# EasyEDA Pro project 平衡车.eprj

# Schematic Schematic1

## Sheets
1 stm32: Create Date: 2022-08-05; Page Name: stm32; Project Name: 平衡车; Schematic Name: Schematic1; Update Date: 2022-08-08
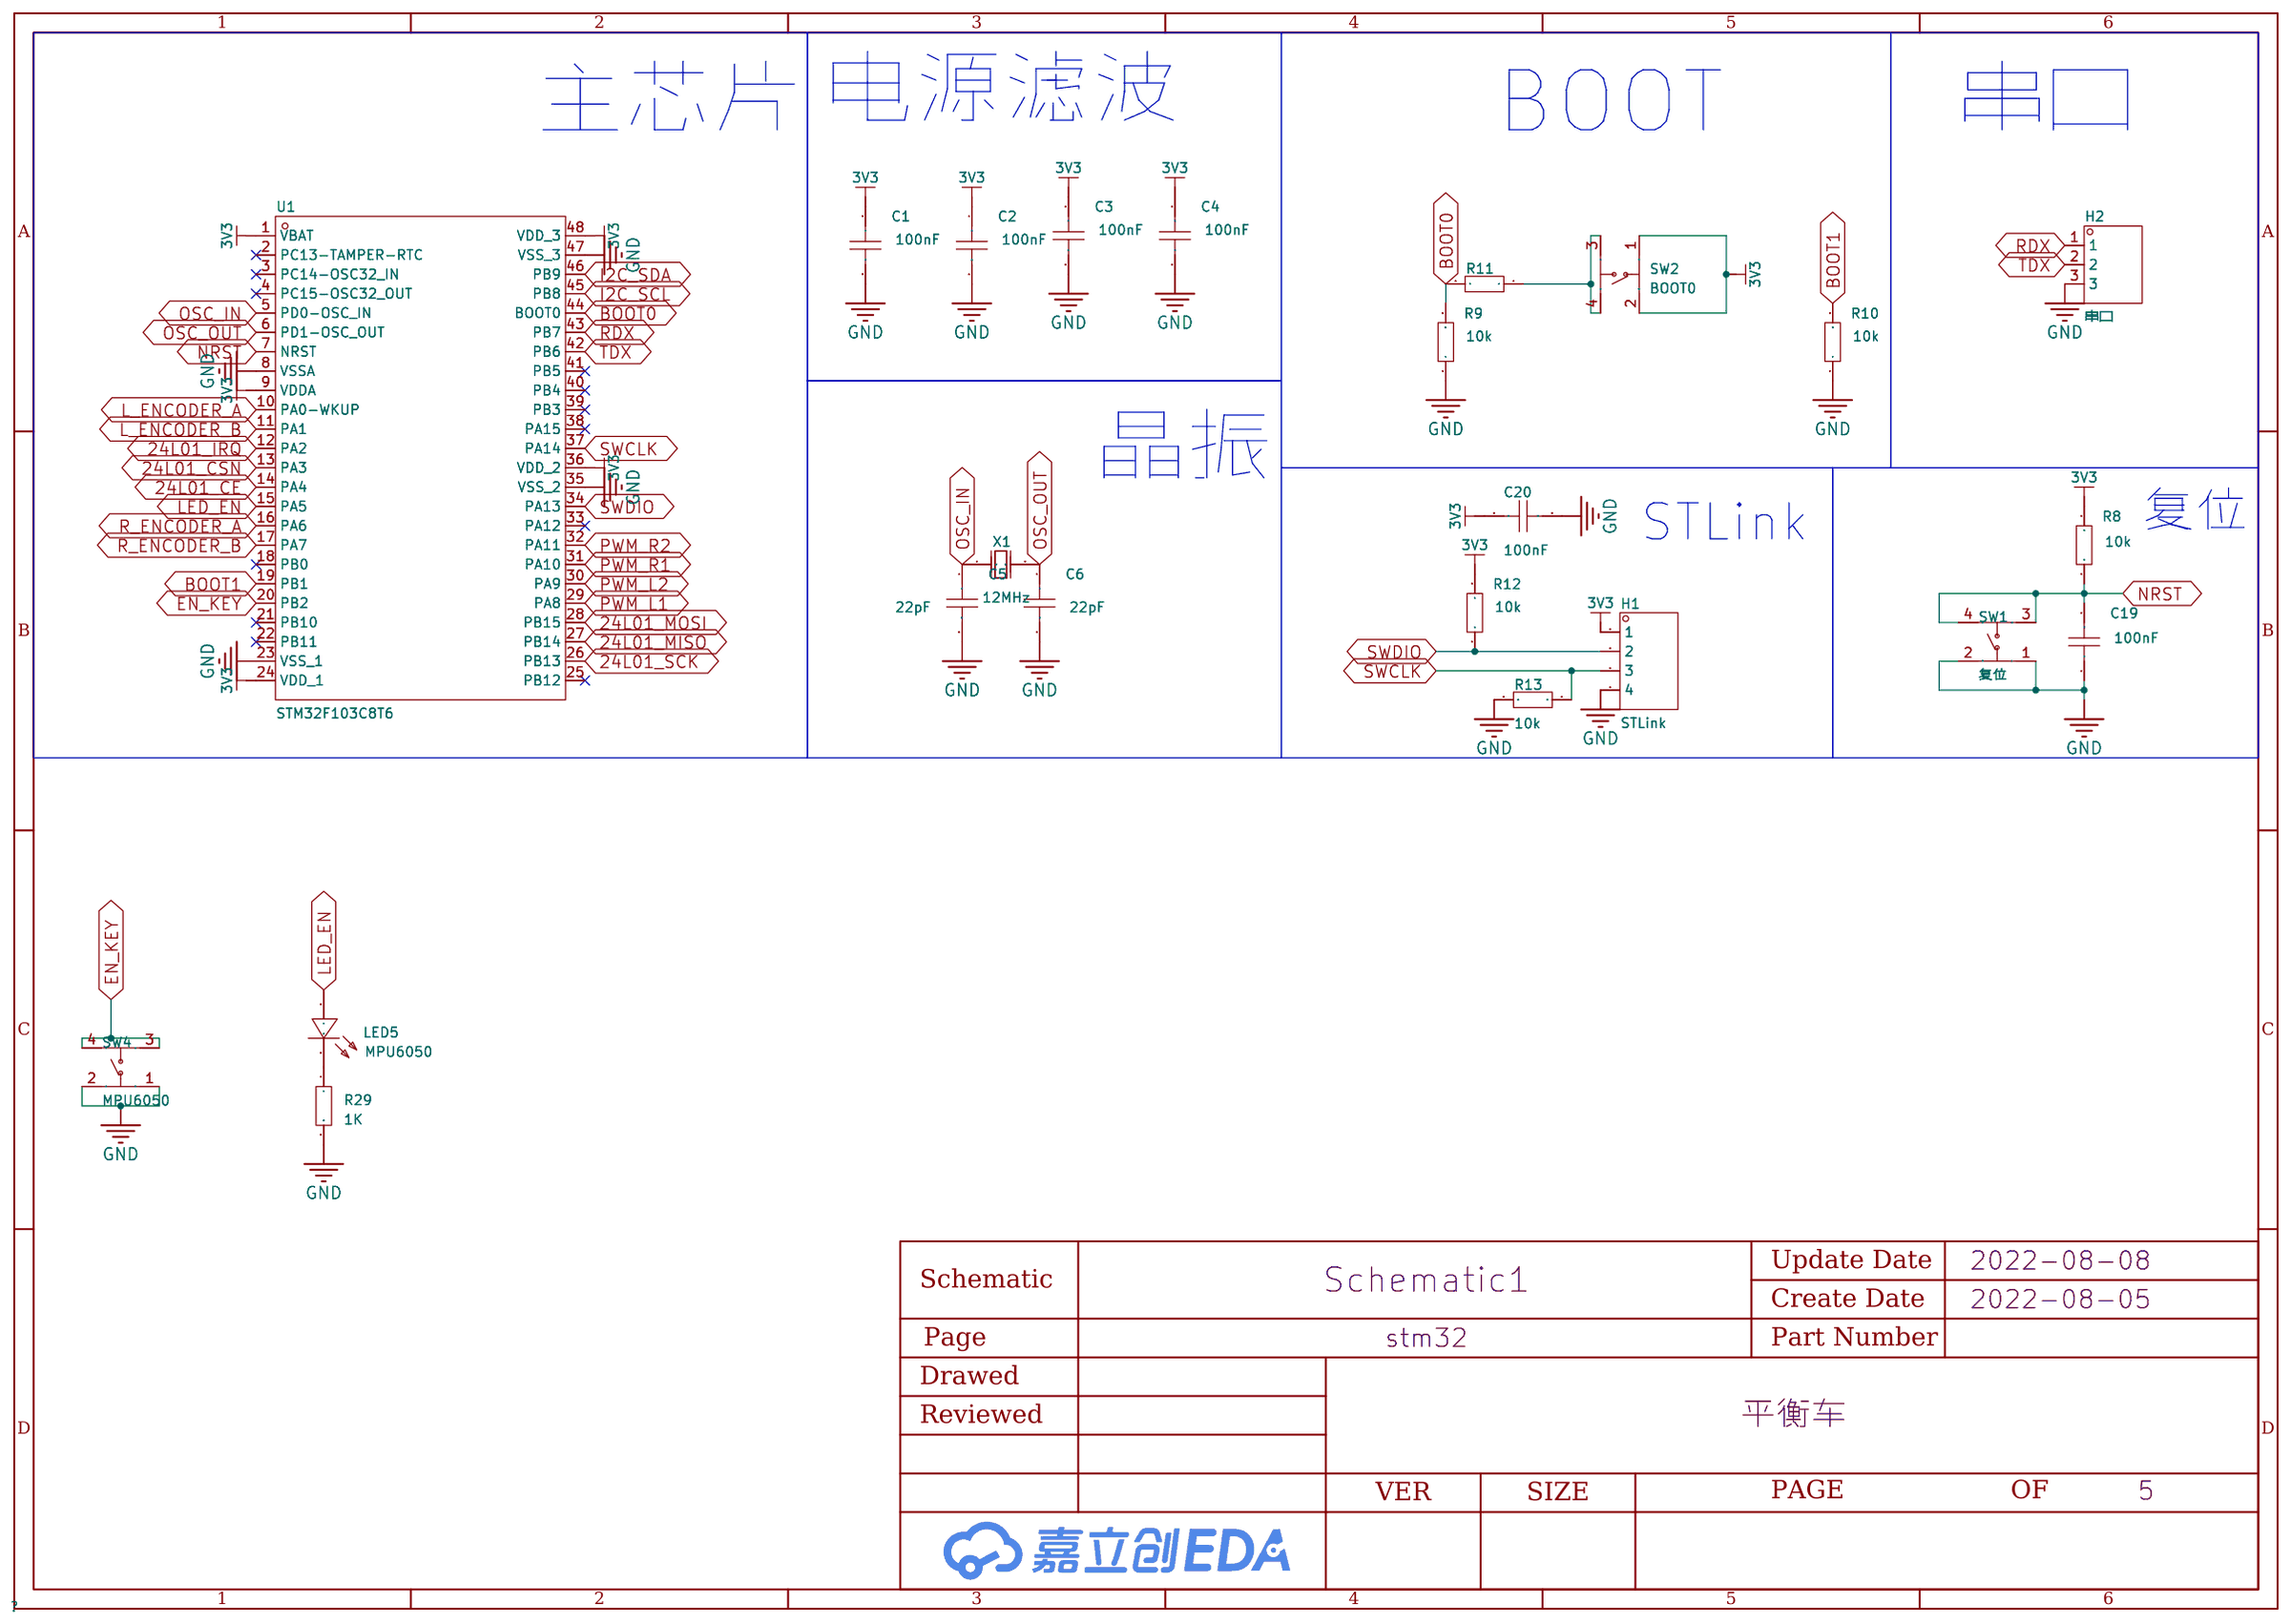
[diagram p0: stm32]
2 mpu6050: Page Name: mpu6050; Update Date: 2022-08-24; Add into BOM: yes; Convert to PCB: yes
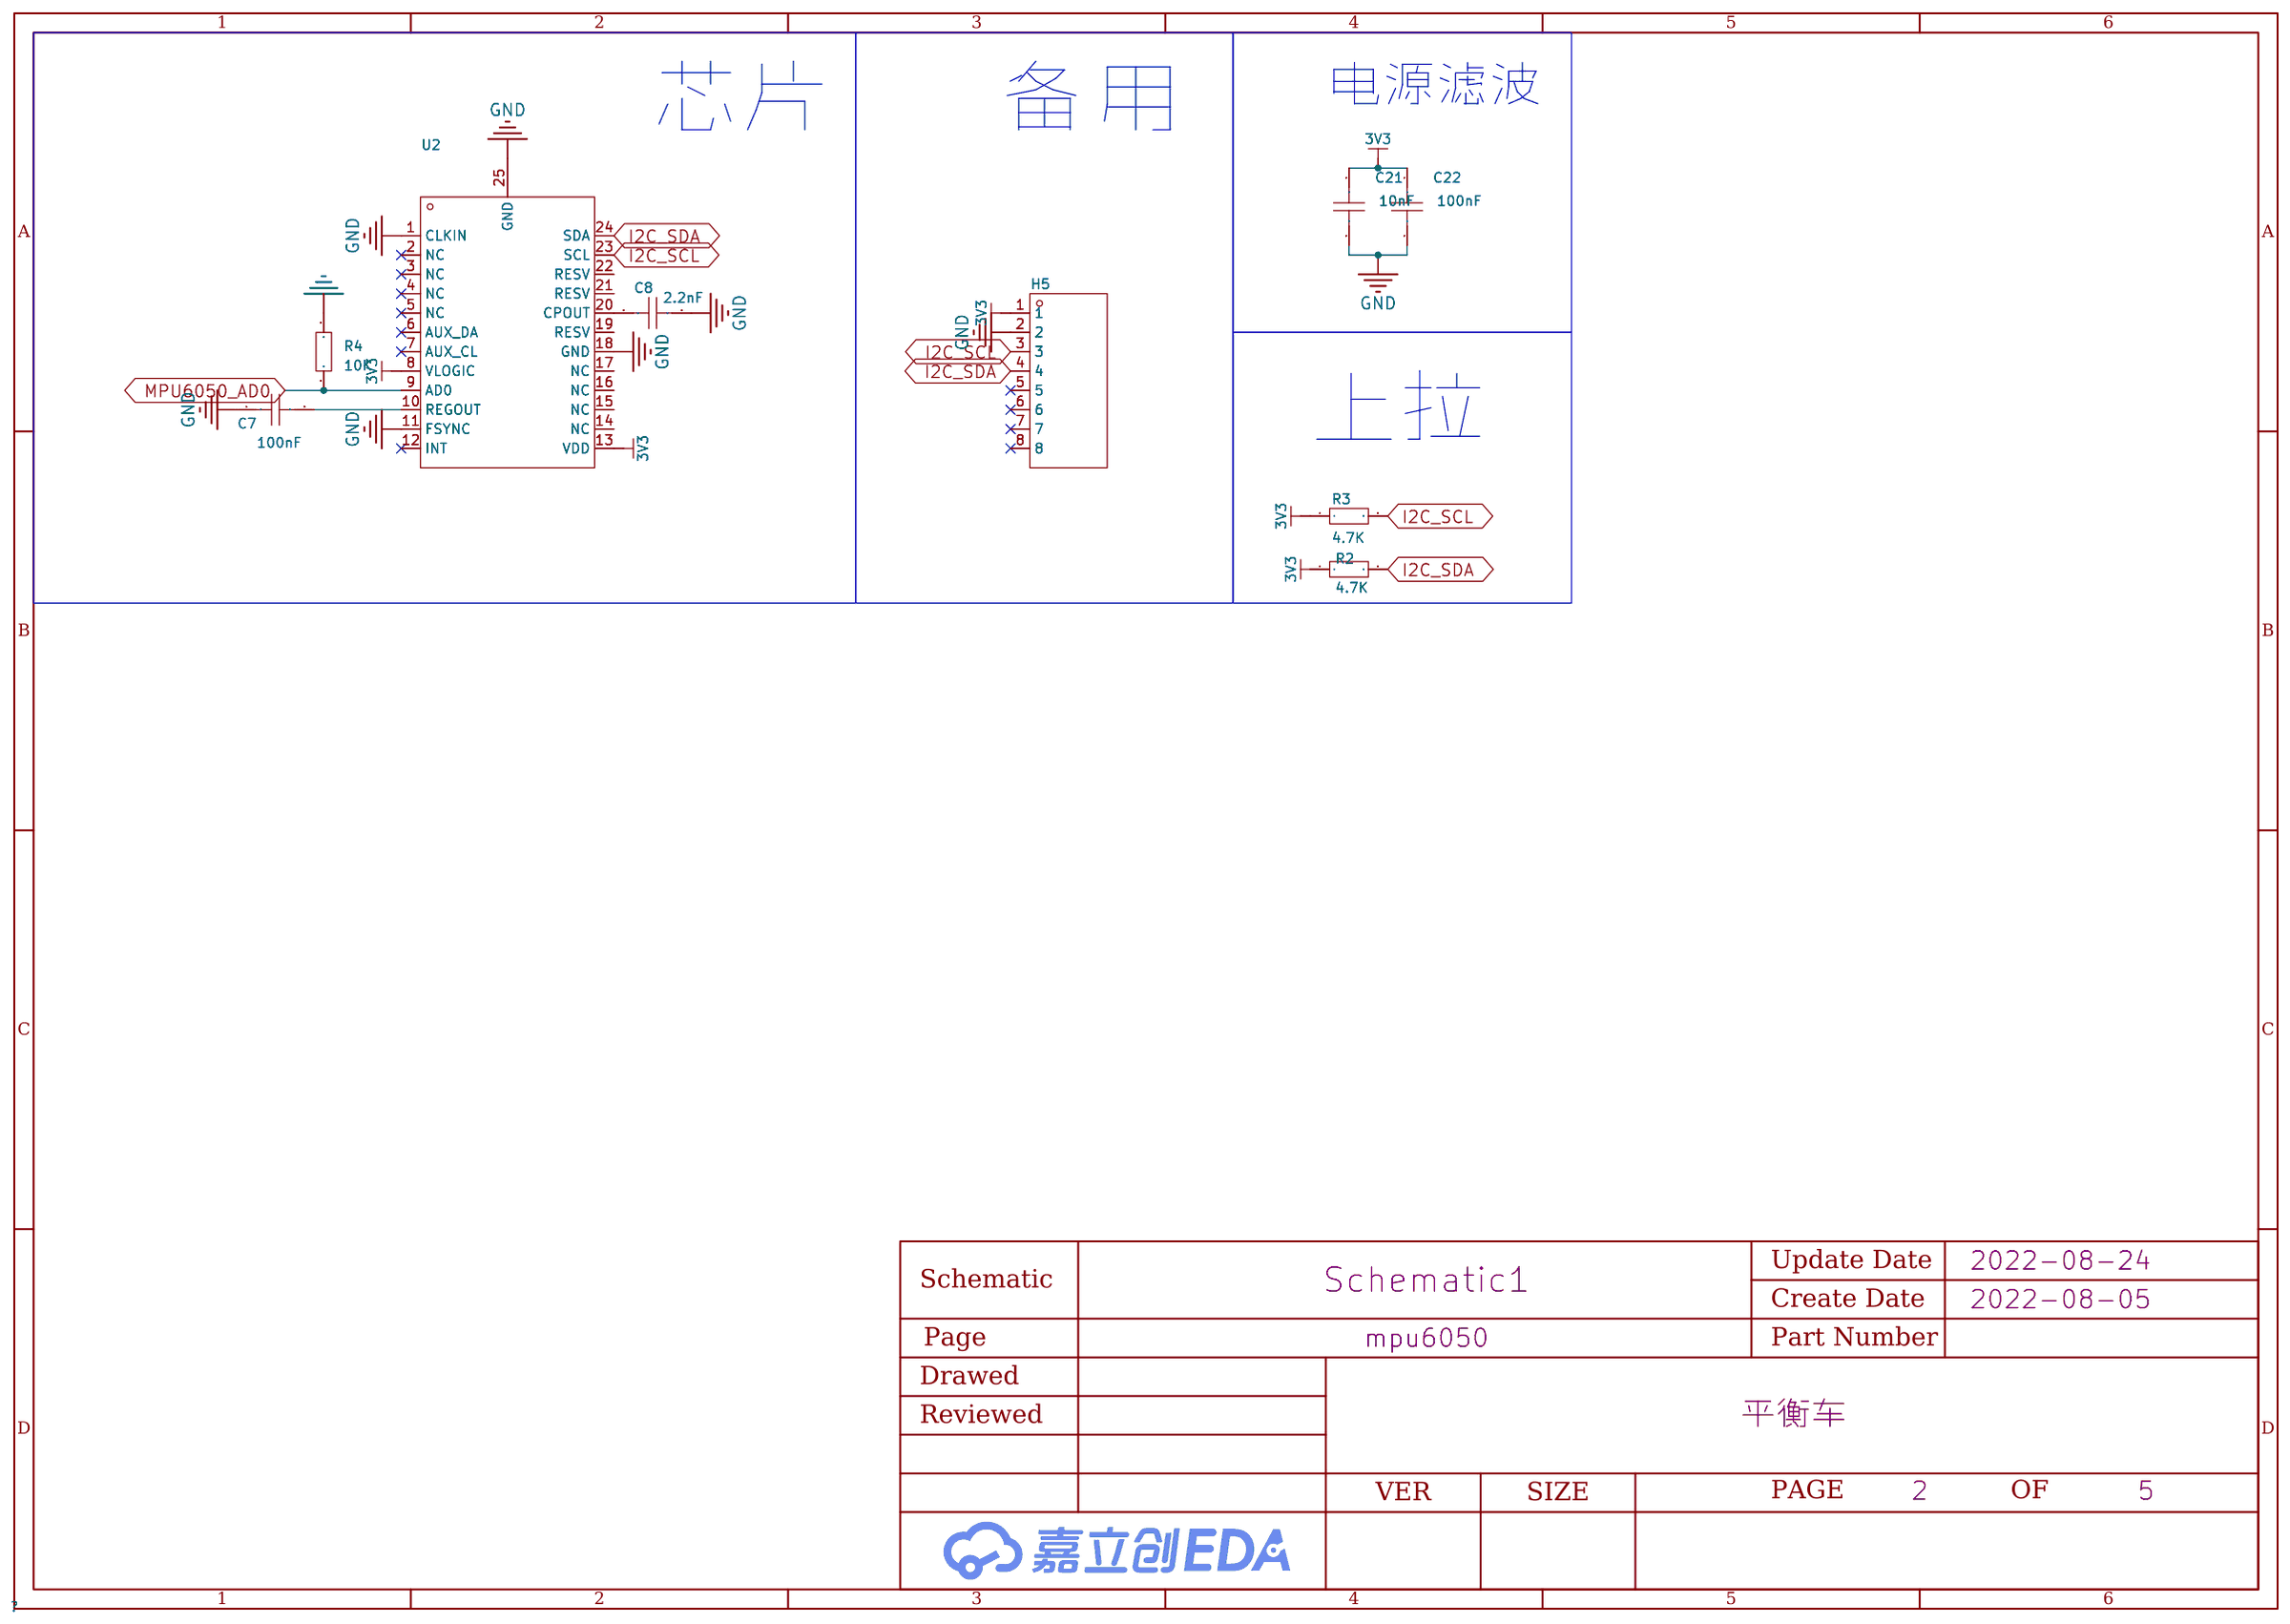
[diagram p1: mpu6050]
3 L298n: Page Name: L298n
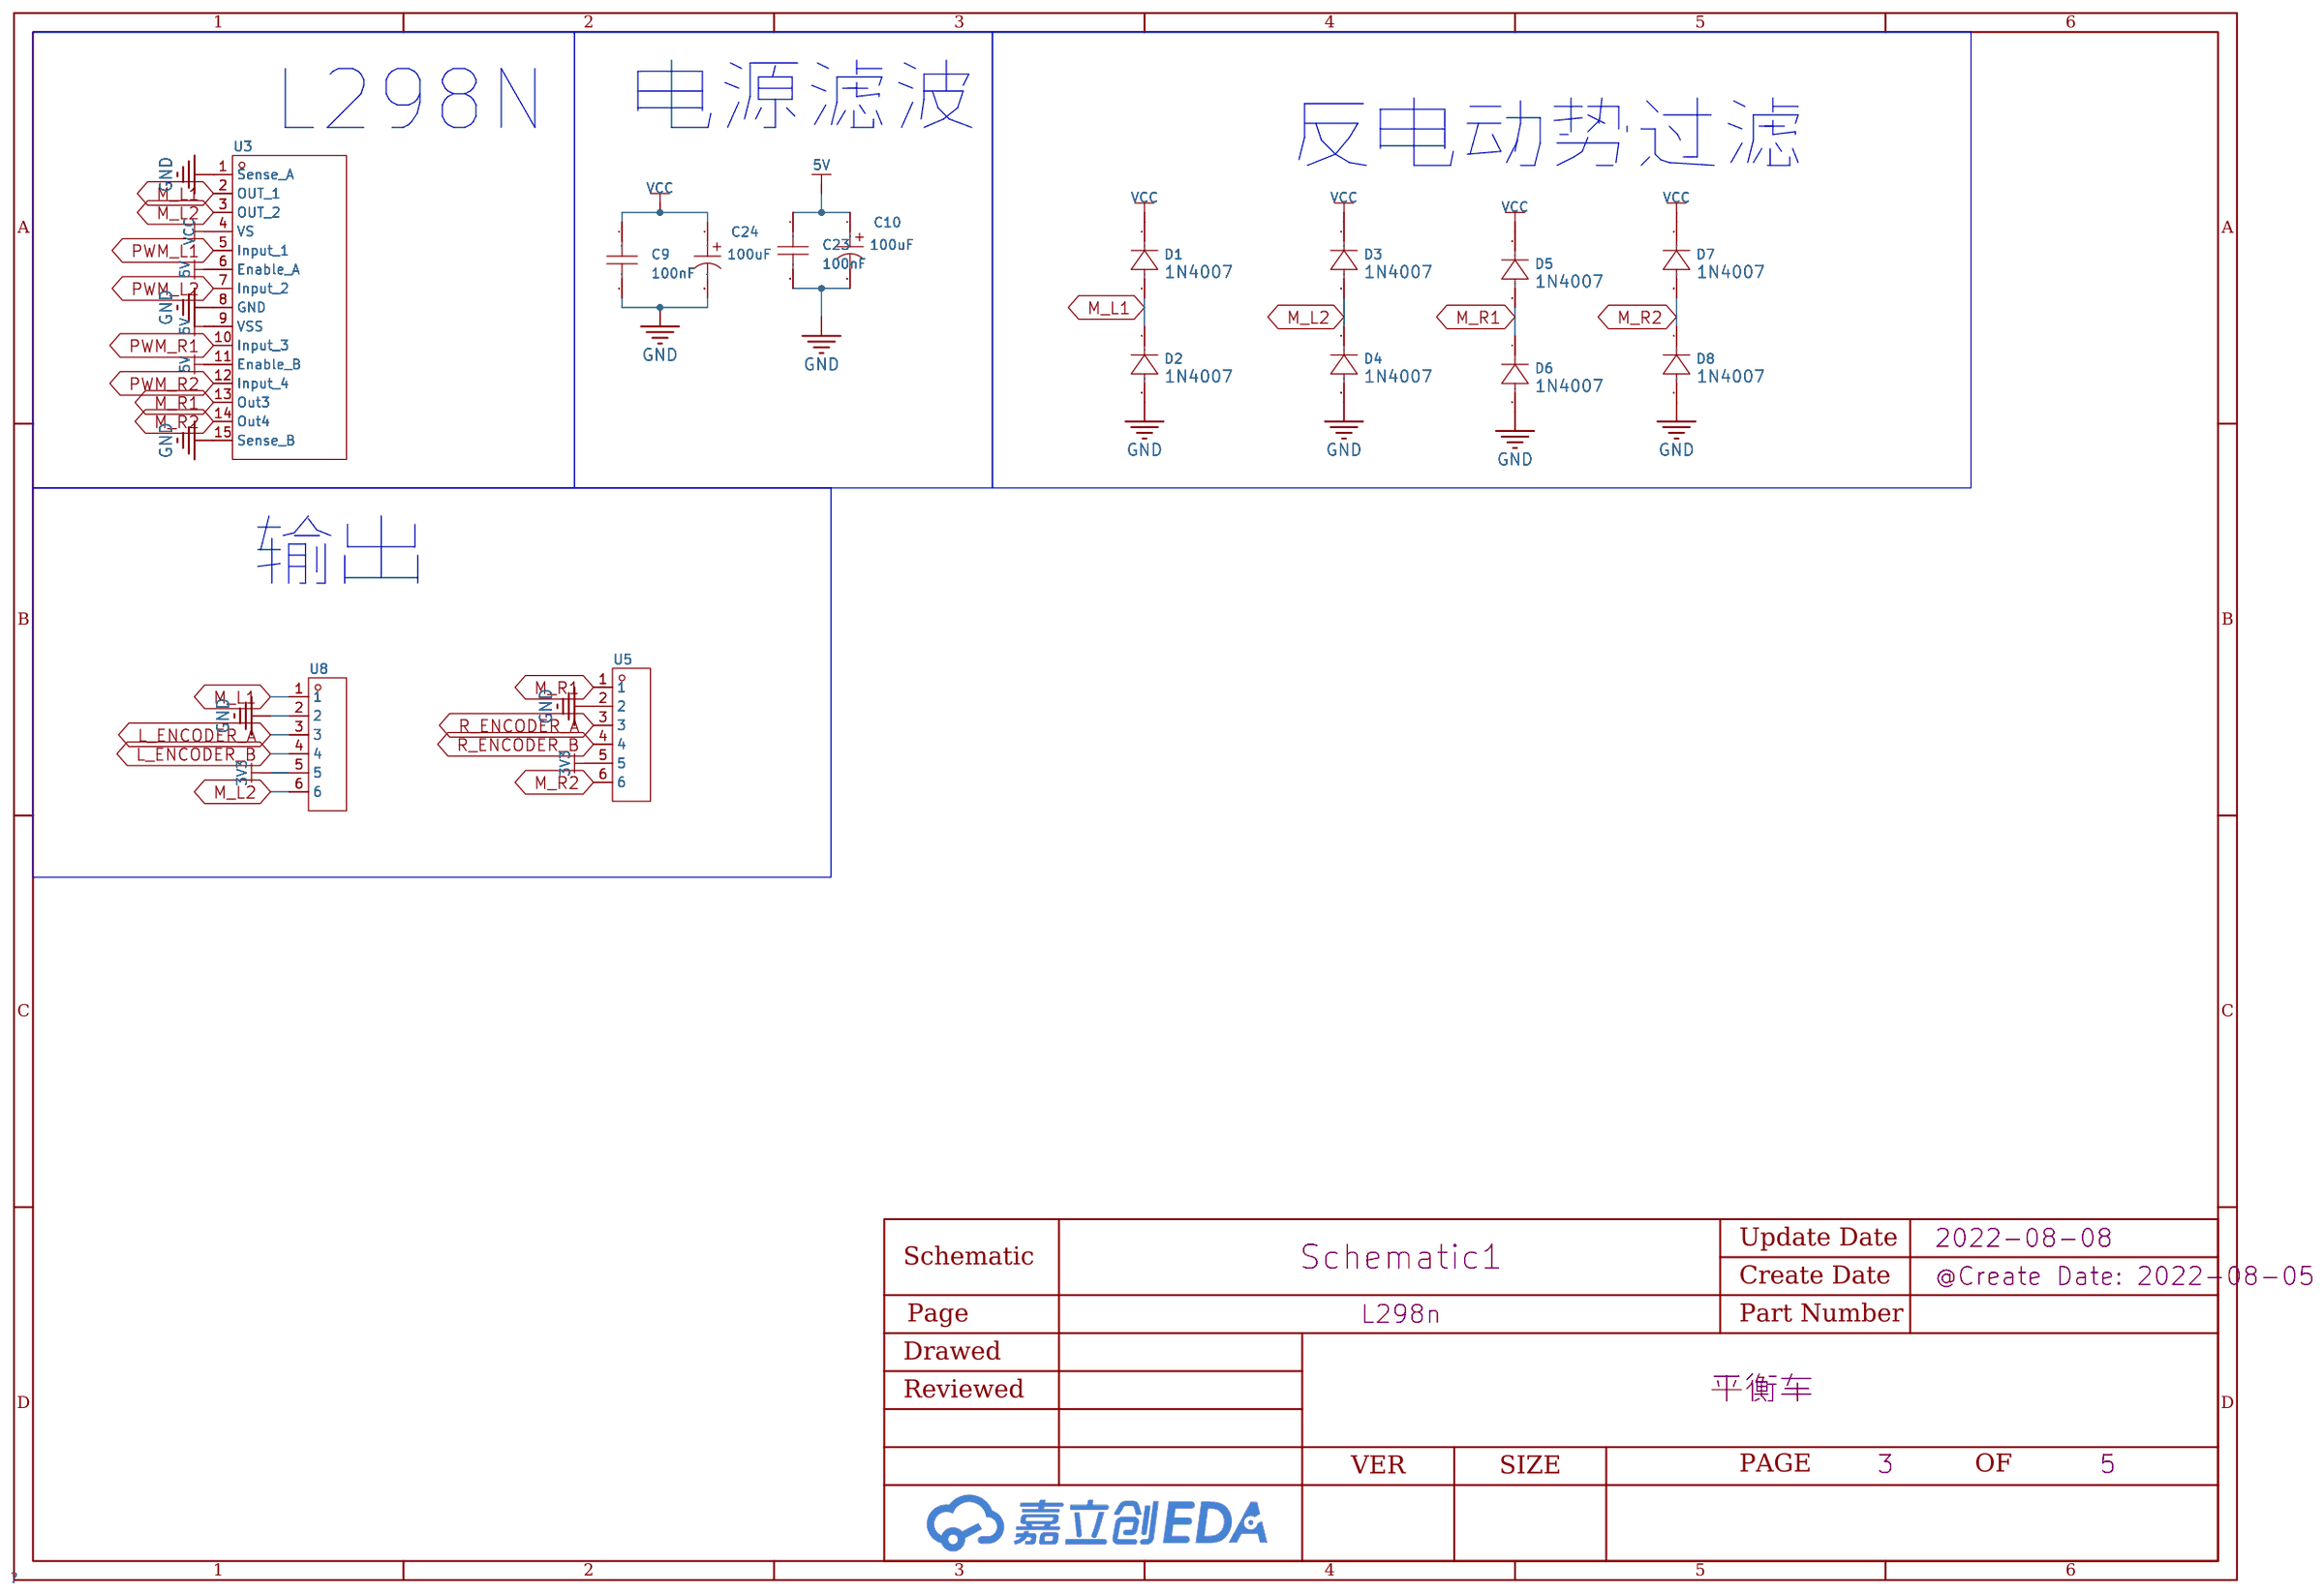
[diagram p2: L298n]
4 电源: Page Name: 电源; Update Date: 2022-08-09; Add into BOM: yes; Convert to PCB: yes
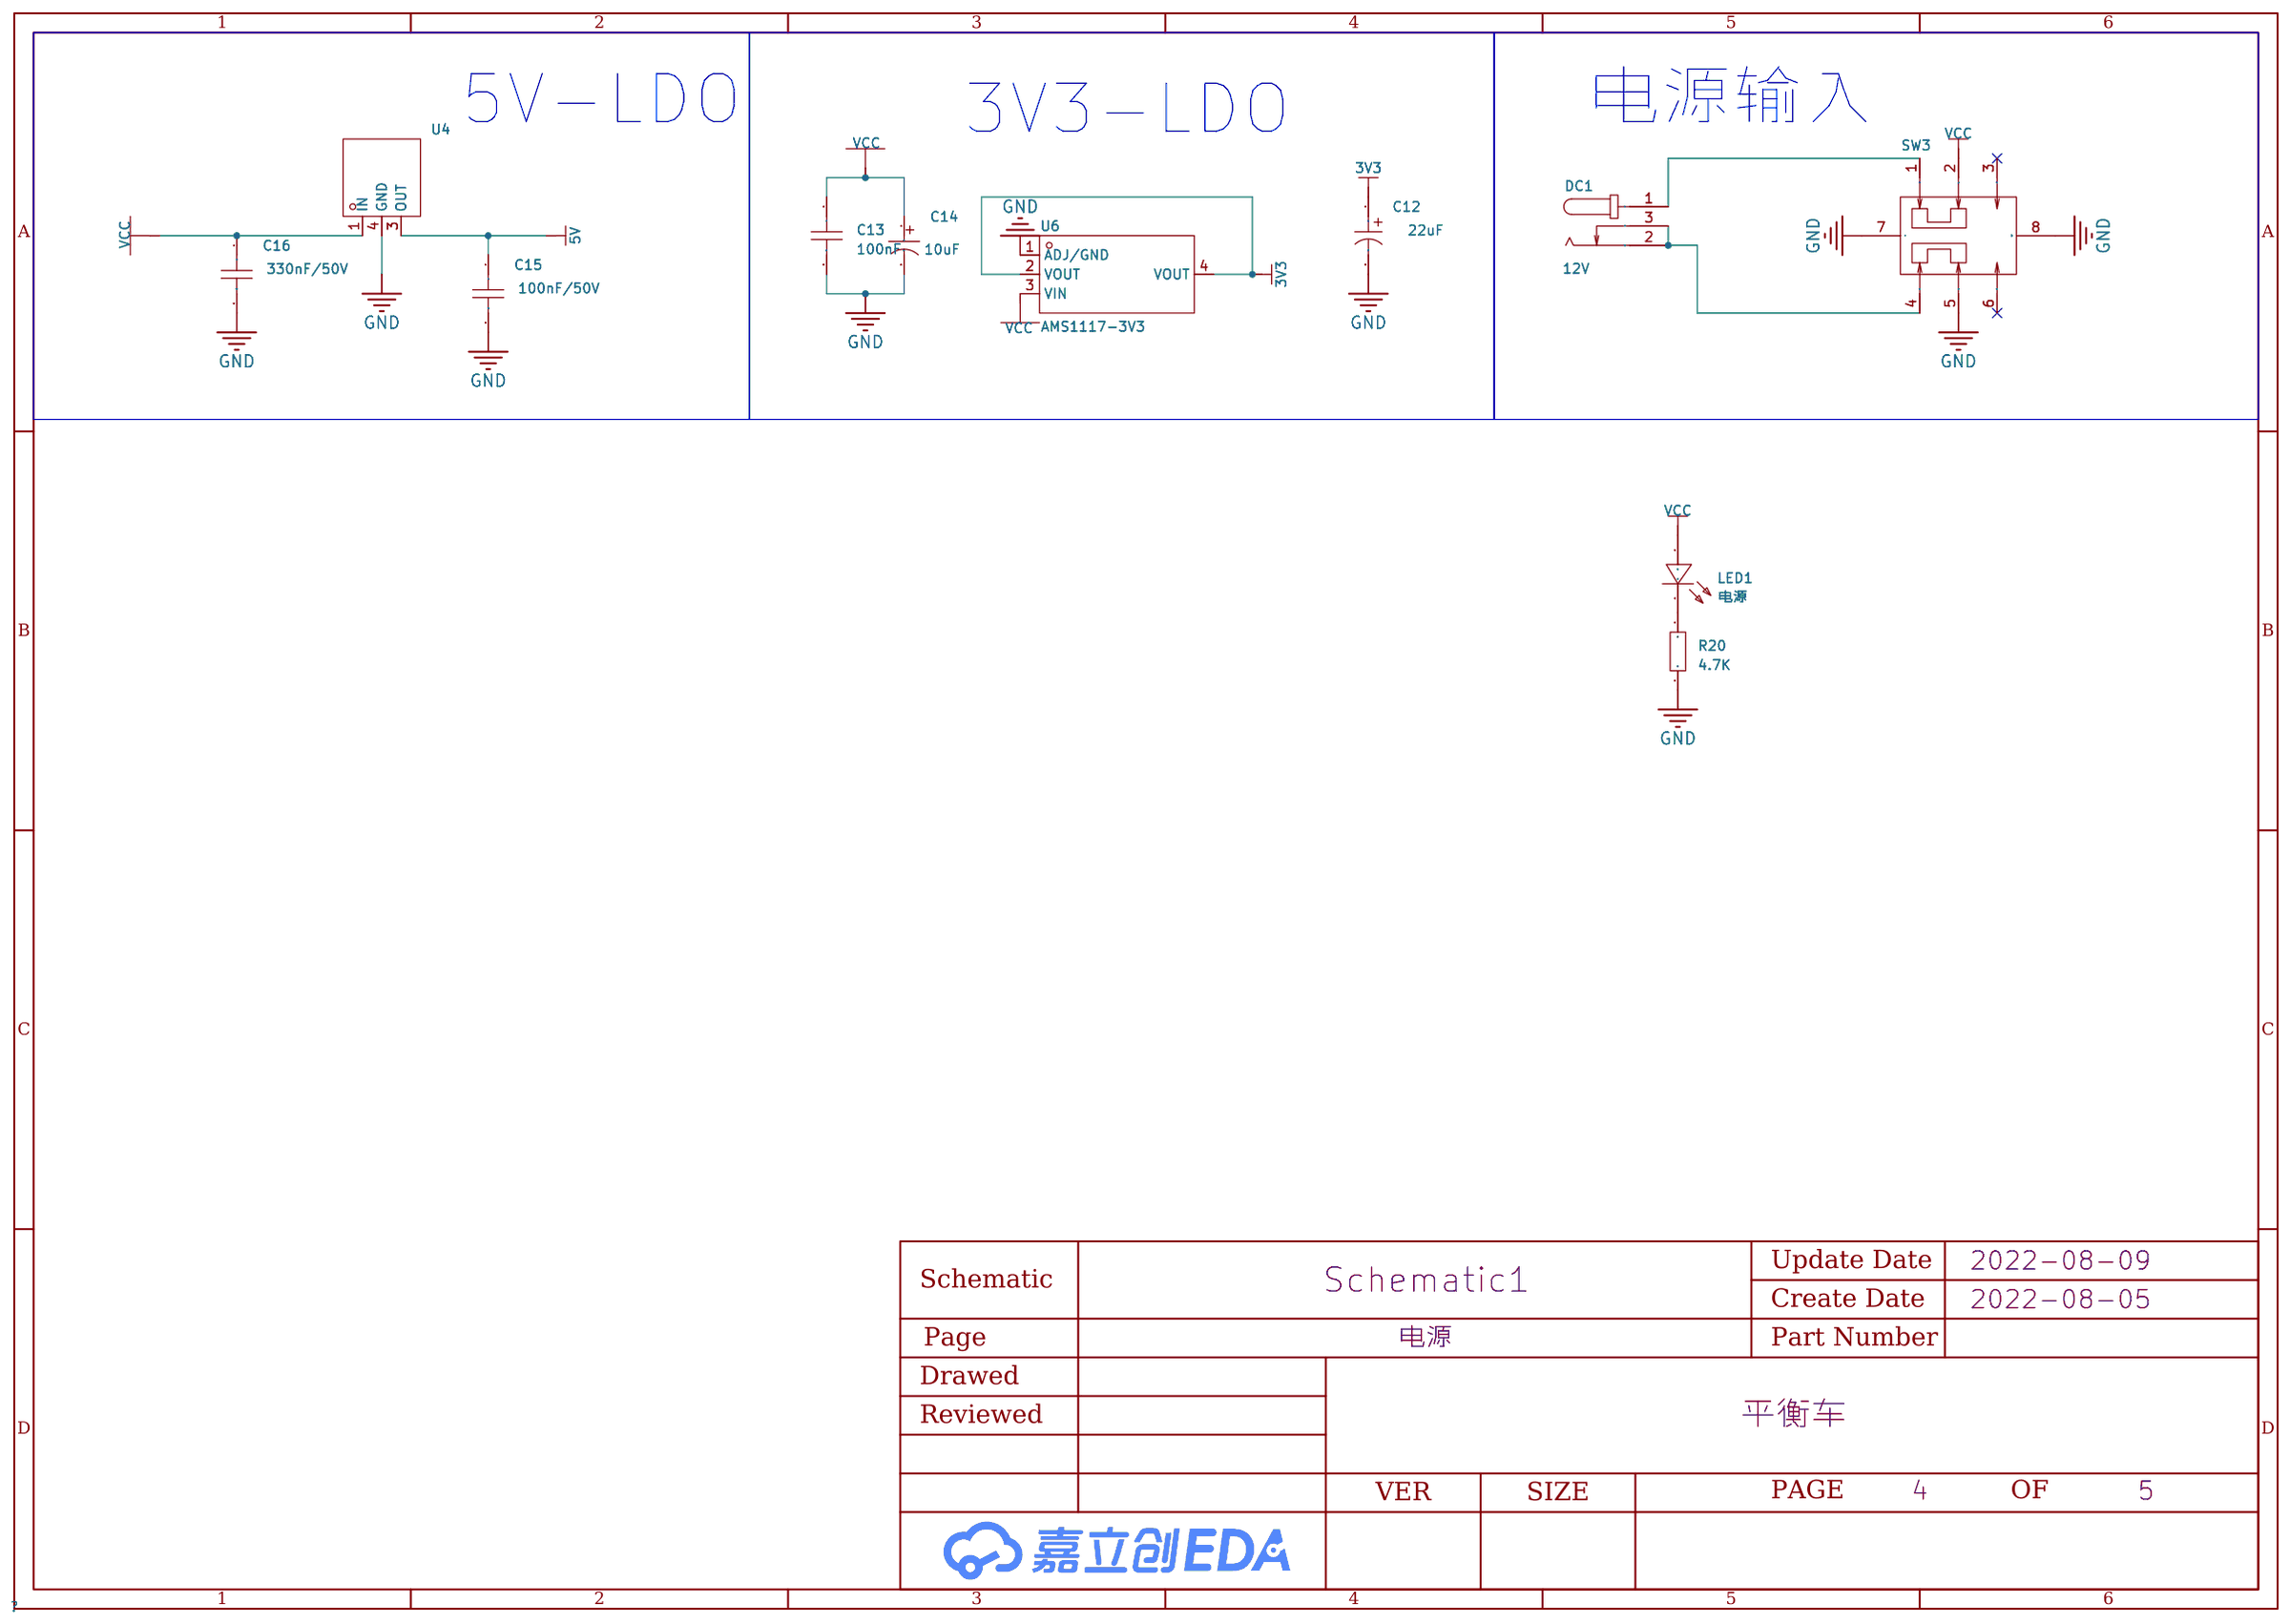
[diagram p3: 电源]
5 NRF24L01+模块: Create Date: 2022-08-08; Page Name: NRF24L01+模块
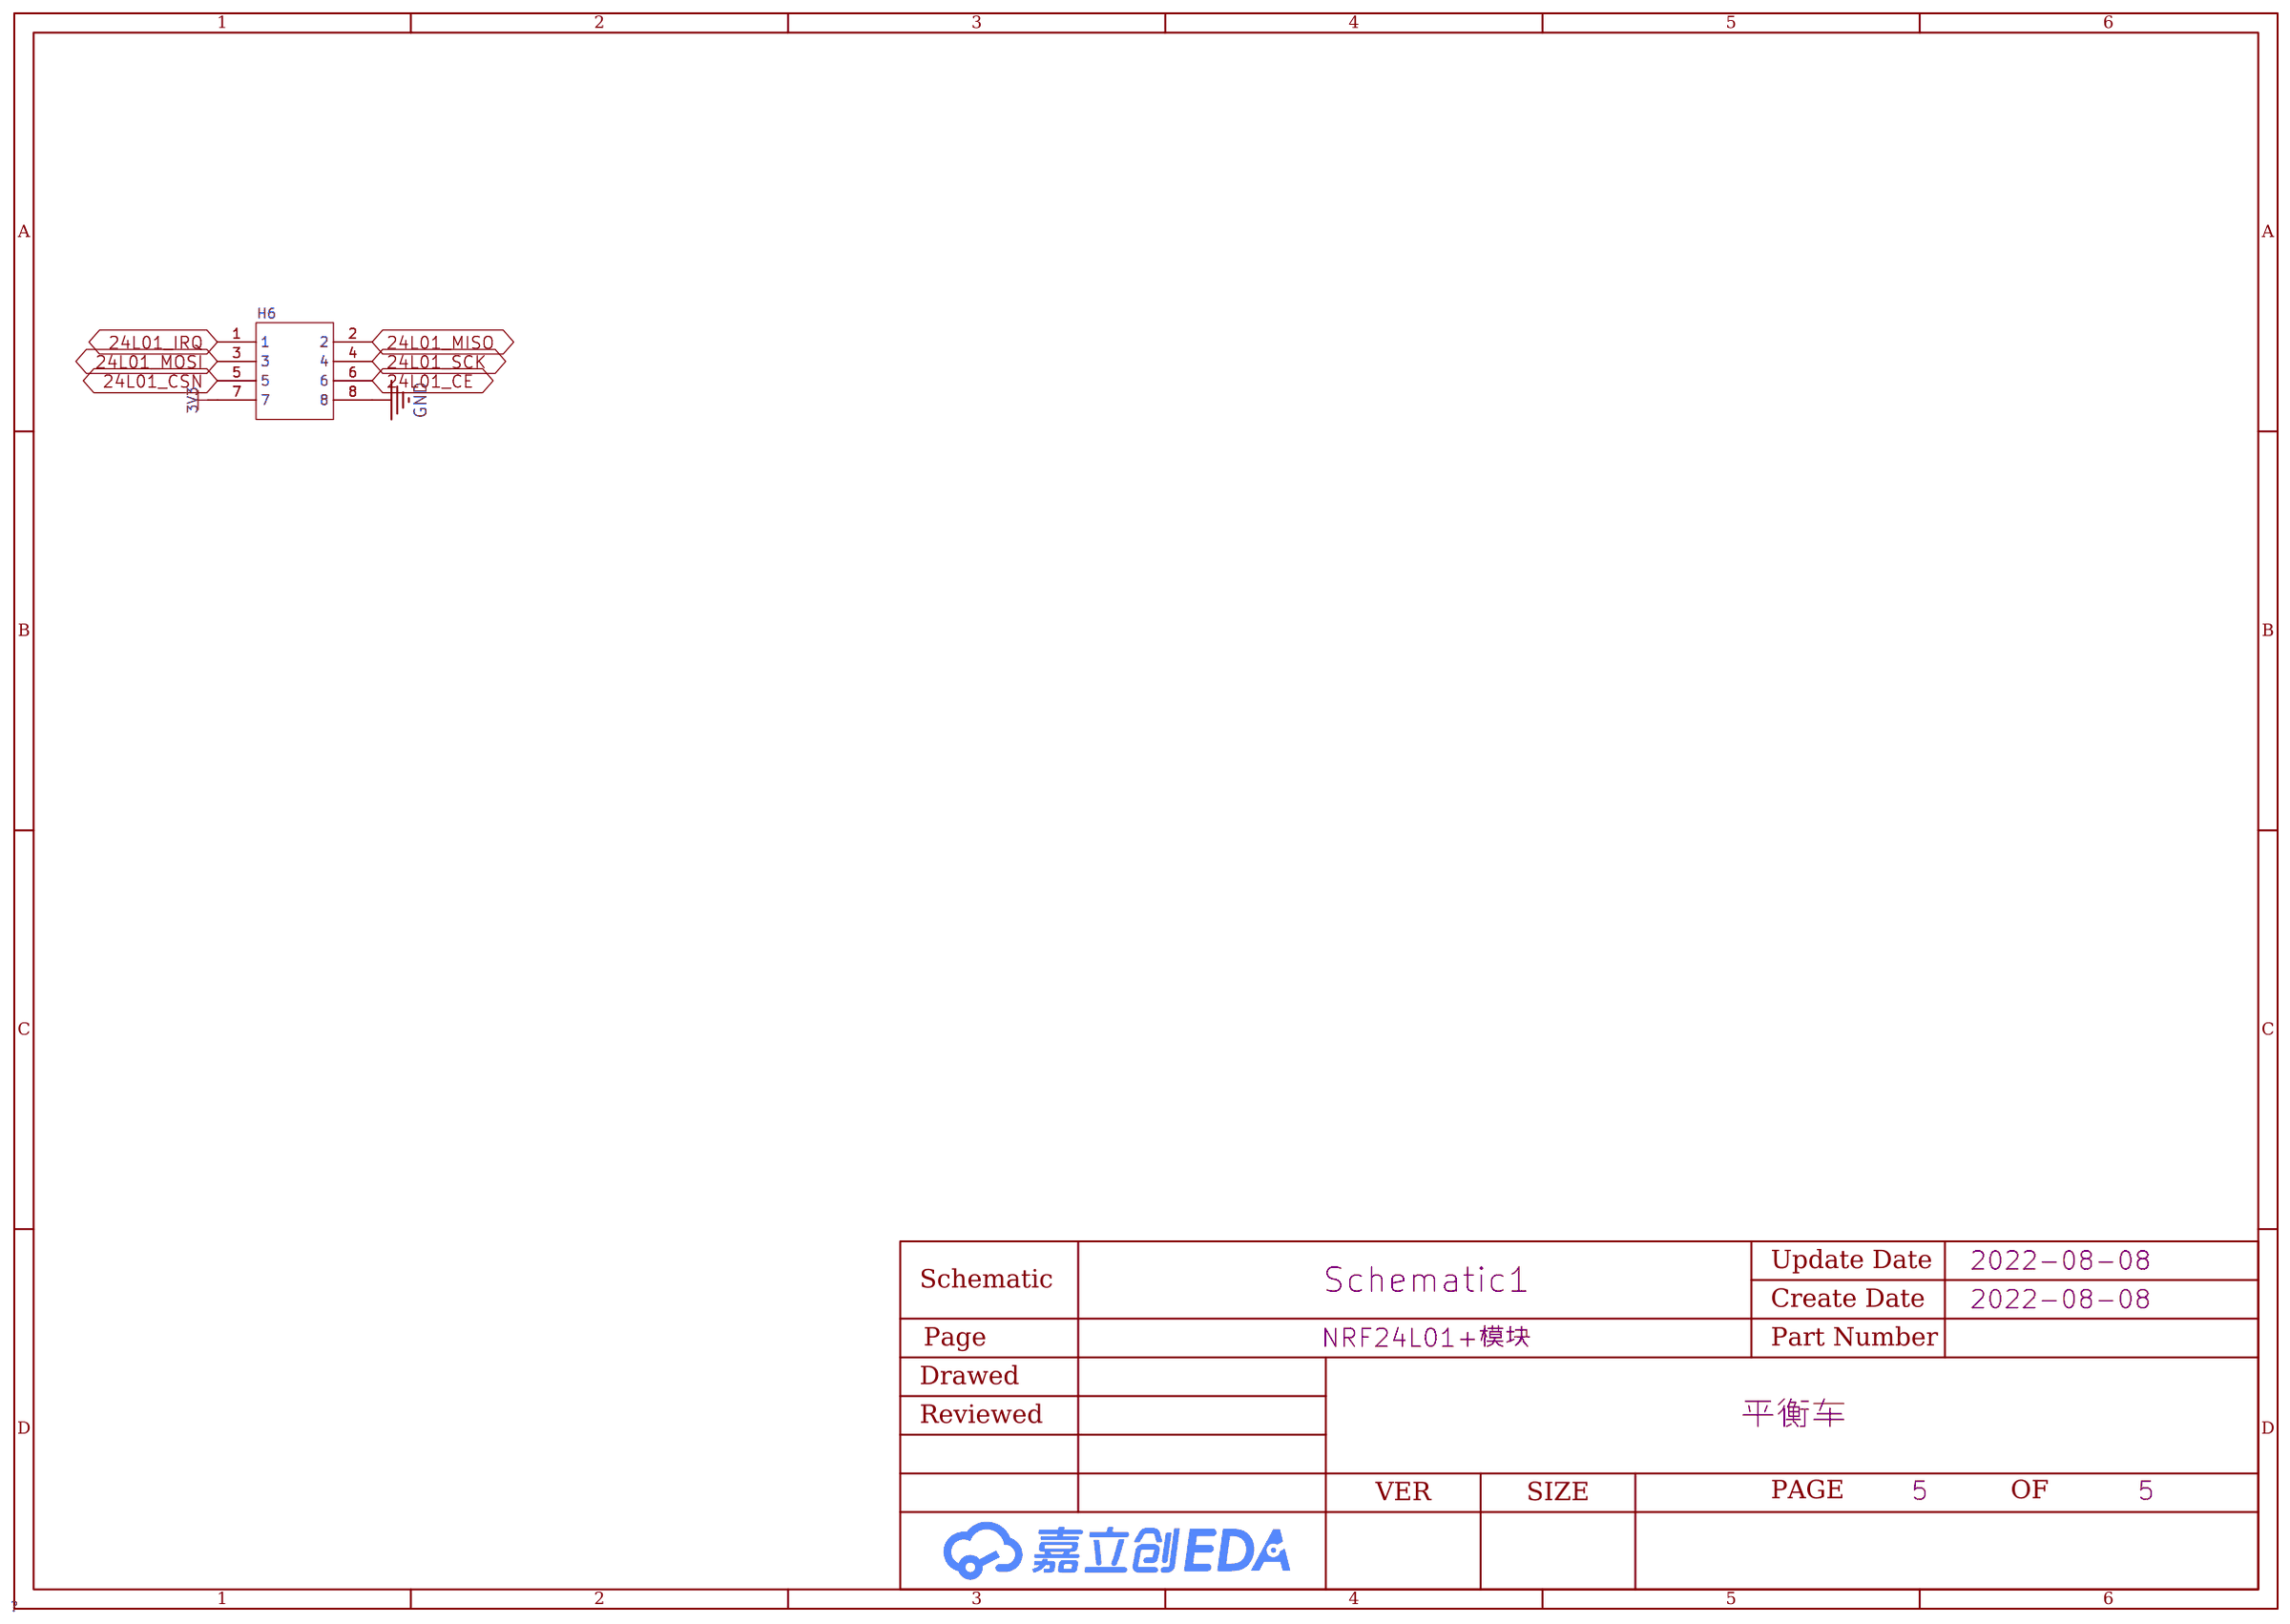
[diagram p4: NRF24L01+模块]

## Parts
sheet L298n
C9  100nF  [C0805]
C10  100uF  [CAP-TH_BD8.0-P3.50-D0.6-FD]
C23  100nF  [C0805]
C24  100uF  [CAP-TH_BD8.0-P3.50-D0.6-FD]
D1  1N4007  [SMA_L4.4-W2.8-LS5.4-RD]
D2  1N4007  [SMA_L4.4-W2.8-LS5.4-RD]
D3  1N4007  [SMA_L4.4-W2.8-LS5.4-RD]
D4  1N4007  [SMA_L4.4-W2.8-LS5.4-RD]
D5  1N4007  [SMA_L4.4-W2.8-LS5.4-RD]
D6  1N4007  [SMA_L4.4-W2.8-LS5.4-RD]
D7  1N4007  [SMA_L4.4-W2.8-LS5.4-RD]
D8  1N4007  [SMA_L4.4-W2.8-LS5.4-RD]
U3  -  [MULTIWATT-15_L19.6-W5.0-P1.27-L]
U5  -  [CONN-TH_6P_PH2.0D-L-6P]
U8  -  [CONN-TH_6P_PH2.0D-L-6P]
sheet mpu6050
C7  100nF  [C0805]
C8  2.2nF  [C0805]
C21  10nF  [C0805]
C22  100nF  [C0805]
H5  A2541HWV-8P  [HDR-TH_8P-P2.54-V_A2541HWV-8P]
R2  4.7K  [R0805]
R3  4.7K  [R0805]
R4  10K  [R0805]
U2  -  [QFN-24_L4.0-W4.0-P0.50-BL-EP2.7]
sheet NRF24L01+模块
H6  A2541WV-2x4P  [HDR-TH_8P-P2.54-V-R2-C4-S2.54_A2541WV-2X4P]
sheet stm32
C1  100nF  [C0805]
C2  100nF  [C0805]
C3  100nF  [C0805]
C4  100nF  [C0805]
C5  22pF  [C0805]
C6  22pF  [C0805]
C19  100nF  [C0805]
C20  100nF  [C0805]
H1  STLink  [HDR-TH_4P-P2.54-V-M]
H2  串口  [HDR-TH_3P-P2.54-V-M-1]
LED5  MPU6050  [LED0805-R-RD]
R8  10k  [R0805]
R9  10k  [R0805]
R10  10k  [R0805]
R11  100R  [R0805]
R12  10k  [R0805]
R13  10k  [R0805]
R29  1K  [R0805]
SW1  复位  [SW-SMD_4P-L6.0-W6.0-P4.50-LS9.0-2]
SW2  BOOT0  [SW-SMD_4P-L6.0-W6.0-P4.50-LS9.0-2]
SW4  MPU6050  [SW-SMD_4P-L6.0-W6.0-P4.50-LS9.0-2]
U1  STM32F103C8T6  [LQFP-48_L7.0-W7.0-P0.50-LS9.0-BL]
X1  -  [HC-49S_L11.4-W4.8]
sheet 电源
C12  22uF  [CAP-TH_BD5.0-P2.00-D0.6-FD]
C13  100nF  [C0805]
C14  10uF  [CAP-TH_BD5.0-P2.00-D0.8-FD]
C15  100nF/50V  [C0805]
C16  330nF/50V  [C0805]
DC1  12V  [DC-IN-TH_DC005-T20]
LED1  电源  [LED0805-R-RD]
R20  4.7K  [R0805]
SW3  -  [SW-TH_6P-L16.5-W7.5-P4.0-LS2.6-TL]
U4  -  [TO-252-2_L6.5-W6.1-P4.58-LS10.0-TL]
U6  AMS1117-3V3  [SOT-223-3_L6.7-W3.7-P2.30-LS7.0-BR]

## Library data of the parts
C1-C9 C13 C15 C16 C19-C23 = 0805: Supplier Part: C9900012713; JLCPCB Part Class: Extended Part; Datasheet: https://atta.szlcsc.comnull; Supplier: LCSC
C10 C24 = EEUFR1H101B: 容值:100uF;精度:-;额定电压:50V;电容体直径:-;电容体长度:-;脚间距:-;纹波电流:-;等效串联电阻:-;工作寿命:-;工作温度:-;; LCSC Part Name: 100uF 50V; Supplier Part: C713402; Manufacturer: PANASONIC(松下); Supplier Footprint: 径向引线,8x11.5mm; JLCPCB Part Class: Extended Part; Datasheet: https://atta.szlcsc.com/upload/public/pdf/source/20200731/C713402_01730B9A9F8C3659B0307CD3E7293605.pdf; Supplier: LCSC; Rated Voltage: 50V
D1-D8 = 1N4007: 二极管配置:独立式;直流反向耐压(Vr):1kV;平均整流电流(Io):1A;正向压降(Vf):1.1V@1A;反向电流(Ir):5A@1kV;; LCSC Part Name: 1kV 1A 1.1V@1A; Supplier Part: C727081; Manufacturer: TWGMC(台湾迪嘉); Supplier Footprint: SMA(DO-214AC); JLCPCB Part Class: Extended Part; Datasheet: https://atta.szlcsc.com/upload/public/pdf/source/20200828/C727079_3A05254382567072883400655AE0ED46.pdf; Supplier: LCSC; Diode Configuration: 独立式; Reverse Voltage (Vr): 1kV; Average Rectified Current (Io): 1A; Forward Voltage (Vf@If): 1.1V@1A; Reverse Leakage Current: 5A@1kV
U3 = L298N: 双全桥驱动IC; Supplier Part: C19922; Manufacturer: ST(意法半导体); Supplier Footprint: Multiwatt15V; JLCPCB Part Class: Extended Part; Datasheet: https://atta.szlcsc.com/upload/public/pdf/source/20131014/1457706655076.pdf; Supplier: LCSC
U5 U8 = PH2.0D-L-6P: Supplier Part: C9900007791; Supplier Footprint: PH-6A(RED); JLCPCB Part Class: Extended Part; Datasheet: https://atta.szlcsc.comnull; Supplier: LCSC
H5 = A2541HWV-8P: 间距:2.54mm;总孔位数:8;排数:1;插孔结构:1x8P;行距:-;安装类型:直插;塑高:-;触头材质:黄铜;触头镀层:金;; LCSC Part Name: 2.54mm 1x8P; Supplier Part: C225505; Manufacturer: CJT(长江连接器); Supplier Footprint: 直插,P=2.54mm; JLCPCB Part Class: Extended Part; Datasheet: https://atta.szlcsc.com/upload/public/pdf/source/20180509/C225505_D461B2C3971046E1D5997EFE3FFE99C9.pdf; Supplier: LCSC; Pitch: 2.54mm; Number of Holes: 8; Number of Rows: 1; Holes Structure: 1x8P; Mounting Type: 直插; Contact Material: 黄铜; Contact Plating: 金
R2-R4 R8-R13 R20 R29 = 0805: Supplier Part: C9900012715; JLCPCB Part Class: Extended Part; Datasheet: https://atta.szlcsc.comnull; Supplier: LCSC
U2 = MPU-6050: 三轴加速度计和三轴陀螺仪，工作电压：2.375V~3.46V; Supplier Part: C24112; Manufacturer: TDK InvenSense(应美盛); Supplier Footprint: QFN-24_4x4x05P; JLCPCB Part Class: Basic Part; Datasheet: https://atta.szlcsc.com/upload/public/pdf/source/20140425/1457707046159.pdf; Supplier: LCSC
H6 = A2541WV-2x4P: 间距:2.54mm;总PIN位数:8;排数:2;插针结构:2x4P;行距:2.54mm;安装类型:直插;圆针/方针:方针;额定电流:-;额定电压:-;配合针长度:6mm;塑高:2.54mm;端接针长度:3mm;触头材质:黄铜;触头镀层:-;工作温度范围:-40~+105;颜色:黑色;; LCSC Part Name: 2.54mm 2x4P 直插 方针 镀金; Supplier Part: C225519; Manufacturer: CJT(长江连接器); Supplier Footprint: 插件,P=2.54mm; JLCPCB Part Class: Extended Part; Datasheet: https://atta.szlcsc.com/upload/public/pdf/source/20180509/C225519_93746B99266AA550760B05B3359A404E.pdf; Supplier: LCSC; Pitch: 2.54mm; Number of Pins: 8; Number of Rows: 2; Pin Structure: 2x4P; Row Spacing: 2.54mm; Mounting Type: 直插; Circluar Pins/Square Pins: 方针; Length of Mating Pin: 6mm; Insulation Height: 2.54mm; Length of End Connection Pin: 3mm; Contact Material: 黄铜; Operating Temperature Range: -40~+105; Color: 黑色
H1 = B-2100S04P-A110: 间距:2.54mm;总PIN位数:4;排数:1;插针结构:1x4P;行距:-;安装类型:直插;圆针/方针:-;额定电流:-;额定电压:-;配合针长度:6mm;塑高:2.54mm;端接针长度:3mm;触头材质:黄铜;触头镀层:-;工作温度范围:-40~+105;颜色:黑色;; LCSC Part Name: 2.54mm 1x4P; Supplier Part: C124378; Manufacturer: Ckmtw(灿科盟); Supplier Footprint: 插件,P=2.54mm; JLCPCB Part Class: Extended Part; Datasheet: https://atta.szlcsc.com/upload/public/pdf/source/20170821/C124378_1503303307508901532.pdf; Supplier: LCSC; Pitch: 2.54mm; Number of Pins: 4; Number of Rows: 1; Pin Structure: 1x4P; Mounting Type: 直插; Length of Mating Pin: 6mm; Insulation Height: 2.54mm; Length of End Connection Pin: 3mm; Contact Material: 黄铜; Operating Temperature Range: -40~+105; Color: 黑色
H2 = 77311-102-03LF: 间距:2.54mm;总PIN位数:3;排数:1;插针结构:-;行距:-;安装类型:直插;圆针/方针:-;额定电流:-;额定电压:-;配合针长度:-;塑高:-;触头材质:磷青铜;触头镀层:-;颜色:黑色;; LCSC Part Name: 2.54mm; Supplier Part: C180248; Manufacturer: Amphenol; Supplier Footprint: 插件,P=2.54mm; JLCPCB Part Class: Extended Part; Datasheet: https://atta.szlcsc.com/upload/public/pdf/source/20180329/C180248_62E264527695F7ED58561BB828D45E42.pdf; Supplier: LCSC; Pitch: 2.54mm; Number of Pins: 3; Number of Rows: 1; Mounting Type: 直插; Contact Material: 磷青铜; Color: 黑色
LED1 LED5 = NCD0805G1: 发光颜色:翠绿;; LCSC Part Name: 翠绿; Supplier Part: C84260; Manufacturer: 国星光电; Supplier Footprint: 0805; JLCPCB Part Class: Extended Part; Datasheet: https://atta.szlcsc.com/upload/public/pdf/source/20200820/C84260_AFC7BF57C6FBA034D182BB8D10A67EFE.pdf; Supplier: LCSC; Emitted Color: 翠绿
SW1 SW2 SW4 = KH-6X6X5H-STM: 触点电流:50mA;额定电压(DC):12V;电路结构:单刀单掷;安装方式:立贴;按钮形状:圆形按钮;按钮/盖帽颜色:黑色;机械寿命:80000;引脚样式:鸥翼型;开关长度:6mm;开关宽度:6mm;开关高度:5mm;带支架:否;; Supplier Part: C2837531; Manufacturer: kinghelm(金航标); Supplier Footprint: SMD; JLCPCB Part Class: Extended Part; Datasheet: https://atta.szlcsc.com/upload/public/pdf/source/20210608/C2837531_45E87AB996CE723B09405FF2EA209C4C.pdf; Supplier: LCSC; Contact Current: 50mA; Voltage Rating (DC): 12V; Circuit: 单刀单掷; Mounting Style: 立贴; Actuator Style: 圆形按钮; Actuator/Cap Color: 黑色; Mechanical Life: 80000; Pin Style: 鸥翼型; Switch Length: 6mm; Switch Width: 6mm; Switch Height: 5mm; Strike Gundam: 否
U1 = STM32F103C8T6: CPU位数:32-Bit;ROM类型:FLASH;CPU内核:ARM® Cortex®-M3;主频（MAX):72MHz;工作电压:2V ~ 3.6V;; LCSC Part Name: STM32F103C8T6 MSL=3; Supplier Part: C8734; Manufacturer: ST(意法半导体); Supplier Footprint: LQFP-48_7x7x05P; JLCPCB Part Class: Basic Part; Datasheet: https://atta.szlcsc.com/upload/public/pdf/source/20140724/1457707174202.pdf; Supplier: LCSC; Core Size: 32-Bit; Program Memory Type: FLASH; Core Processor: ARM® Cortex®-M3; Speed: 72MHz; Voltage - Supply (Vcc/Vdd): 2V ~ 3.6V; Program Memory Size: 64KB; RAM Size: 20KB; Number of I/O: 37; A/D: 10x12bit; D/A: 0; PWM: 13; LCD: 0; UART/USART: 3 USART; SPI: 2; I2C（SMBUS/PMBUS）: 2; USB Device: 1; CAN: 1; Ethernet: 0
X1 = HCM4916000000ABJT: 晶振类型:-;频率:-;频率公差:-;负载电容:-;工作温度:-;; LCSC Part Name: CRYSTAL 16MHZ 18PF ±30ppm; Supplier Part: C326544; Manufacturer: CITIZEN; Supplier Footprint: HC-49S/SMD; JLCPCB Part Class: Extended Part; Datasheet: https://atta.szlcsc.com/upload/public/pdf/source/20181213/C326544_5157A46CC86ED04531B6869DF957F8E1.pdf; Supplier: LCSC
C12 = LW220M0500511PV2-D5: LCSC Part Name: 22uF 50V; Supplier Part: C2847230; Manufacturer: UNITED(怡德); Supplier Footprint: 径向引线,5x11mm; JLCPCB Part Class: Extended Part; Datasheet: https://atta.szlcsc.com/upload/public/pdf/source/20210723/C2847230_6E41DE0F8E72341694F7D9843C90A4AD.pdf; Supplier: LCSC
C14 = KM106M025D11RR0VH2FP0: 脚间距:2mm;额定电压:25V;纹波电流:38mA 120Hz;等效串联电阻:-;精度:±20%;电容体直径:5mm;工作温度:-;电容体长度:11mm;容值:10uF;工作寿命:1000hrs 105;; LCSC Part Name: 10uF 25V; Supplier Part: C43347; Manufacturer: CX(承兴); Supplier Footprint: 径向引线,5x11mm; JLCPCB Part Class: Extended Part; Datasheet: https://atta.szlcsc.com/upload/public/pdf/source/20151029/1457707524171.pdf; Supplier: LCSC; Lead Spacing: 2mm; Rated Voltage: 25V; Ripple Current: 38mA 120Hz; Tolerance: ±20%; φD: 5mm; L: 11mm; Lifetime @ Temp: 1000hrs 105
DC1 = DC005-T20: 连接器类型:DC电源插座;安装方式:弯插;触点内径:-;触点外径:6.3mm;额定电流:3A;额定电压:30V;工作温度范围:-10~+60;; LCSC Part Name: 外径:6.3mm B级 全铜; Supplier Part: C111567; Manufacturer: SOFNG(硕方); Supplier Footprint: 插件; JLCPCB Part Class: Extended Part; Datasheet: https://atta.szlcsc.com/upload/public/pdf/source/20170519/1495157966733.pdf; Supplier: LCSC; Connector Type: DC电源插座; Mounting Style: 弯插; Outside Contact Diameter: 6.3mm; Current Rating (Max): 3A; Voltage Rating (Max): 30V; Operating Temperature Range: -10~+60
SW3 = SS-22F08-G012: 额定电流(DC):1A;额定电压(DC):24V;电路结构:双刀双掷;安装方式:直插;机械寿命:10000;开关颜色:黑色;滑钮形状:矩形柱状;引脚样式:PC引脚;工作温度:-25~+70;开关长度:17mm;开关宽度:7.5mm;; LCSC Part Name: 直柄拨动开关SS-22F08 柄长12; Supplier Part: C2848900; Manufacturer: G-Switch(品赞); Supplier Footprint: 插件; JLCPCB Part Class: Extended Part; Datasheet: https://atta.szlcsc.com/upload/public/pdf/source/20210728/C2848900_55ACD45F7585CACC6367A698E38B6368.pdf; Supplier: LCSC; Current Rating (DC): 1A; Voltage Rating (DC): 24V; Circuit: 双刀双掷; Mounting Style: 直插; Mechanical Life: 10000; Actuator Color: 黑色; Actuator Style: 矩形柱状; Pin Style: PC引脚; Operating Temperature: -25~+70; Switch Length: 17mm; Switch Width: 7.5mm
U4 = 78M05: Supplier Part: C2984682; Manufacturer: 集晶电子; Supplier Footprint: TO-252; Datasheet: https://atta.szlcsc.com/upload/public/pdf/source/20220324/BB4E964BA3167DF8D4E6891915312735.pdf; Supplier: LCSC
U6 = AMS1117-5.0: 静态电流(Iq):-;输出类型:固定;最大输入电压:18V;输出电压(可调):-;压降(max):1.5V @ 1A;输出电压(固定):5V;; Supplier Part: C473812; Manufacturer: Slkor(萨科微); Supplier Footprint: SOT-223; JLCPCB Part Class: Extended Part; Datasheet: https://atta.szlcsc.com/upload/public/pdf/source/20201231/C426566_7F22DB93439D00F3FA27143E4F28C6AA.pdf; Supplier: LCSC; Output Configuration: 正; Current - Supply (Max): 5mA; Output Current (Max): 1.4A; Output Type: 固定; Number of Output Channels: 1; Voltage - Input (Max): 18V; Operating Temperature: -40~85; Voltage Dropout (Max): 1.5V @ 1A; Voltage - Output (Fixed): 5V

## Nets
3V3: C1.1 C2.1 C3.1 C4.1 C12.1 C20.1 C21.1 C22.1 H1.1 H5.1 H6.7 R2.1 R3.1 R8.2 R12.2 SW2.1 SW2.2 U1.1(VBAT) U1.9(VDDA) U1.24(VDD_1) U1.36(VDD_2) U1.48(VDD_3) U2.8(VLOGIC) U2.13(VDD) U5.5 U6.2(VOUT) U6.4(VOUT) U8.5
5V: C10.1 C15.1 C23.1 U3.6(Enable A) U3.9(VSS) U3.11(Enable B) U4.3(OUT)
GND: C1.2 C2.2 C3.2 C4.2 C5.2 C6.2 C7.1 C8.2 C9.2 C10.2 C12.2 C13.2 C14.2 C15.2 C16.2 C19.2 C20.2 C21.2 C22.2 C23.2 C24.2 D2.2(A) D4.2(A) D6.2(A) D8.2(A) H1.4 H2.3 H5.2 H6.8 R4.1 R9.1 R10.1 R13.2 R20.2 R29.2 SW1.1 SW1.2 SW3.5 SW3.7 SW3.8 SW4.1 SW4.2 U1.8(VSSA) U1.23(VSS_1) U1.35(VSS_2) U1.47(VSS_3) U2.1(CLKIN) U2.11(FSYNC) U2.18(GND) U2.25(GND) U3.1(Sense A) U3.8(GND) U3.15(Sense B) U4.4(GND) U5.2 U6.1(ADJ/GND) U8.2
VCC: C9.1 C13.1 C14.1 C16.1 C24.1 D1.1(K) D3.1(K) D5.1(K) D7.1(K) LED1.1(A) SW3.2 U3.4(VS) U4.1(IN) U6.3(VIN)
24L01_CE: H6.6 U1.14(PA4)
24L01_CSN: H6.5 U1.13(PA3)
24L01_IRQ: H6.1 U1.12(PA2)
24L01_MISO: H6.2 U1.27(PB14)
24L01_MOSI: H6.3 U1.28(PB15)
24L01_SCK: H6.4 U1.26(PB13)
BOOT0: R9.2 R11.2 U1.44(BOOT0)
BOOT1: R10.2 U1.19(PB1)
EN_KEY: SW4.3 SW4.4 U1.20(PB2)
I2C_SCL: H5.3 R3.2 U1.45(PB8) U2.23(SCL)
I2C_SDA: H5.4 R2.2 U1.46(PB9) U2.24(SDA)
L_ENCODER_A: U1.10(PA0-WKUP) U8.3
L_ENCODER_B: U1.11(PA1) U8.4
LED_EN: LED5.1(A) U1.15(PA5)
M_L1: D1.2(A) D2.1(K) U3.2(OUT 1) U8.1
M_L2: D3.2(A) D4.1(K) U3.3(OUT 2) U8.6
M_R1: D5.2(A) D6.1(K) U3.13(Out3) U5.1
M_R2: D7.2(A) D8.1(K) U3.14(Out4) U5.6
MPU6050_AD0: R4.2 U2.9(AD0)
NRST: C19.1 R8.1 SW1.3 SW1.4 U1.7(NRST)
OSC_IN: C5.1 U1.5(PD0-OSC_IN) X1.1(OSC1)
OSC_OUT: C6.1 U1.6(PD1-OSC_OUT) X1.2(OSC2)
PWM_L1: U1.29(PA8) U3.5(Input 1)
PWM_L2: U1.30(PA9) U3.7(Input 2)
PWM_R1: U1.31(PA10) U3.10(Input 3)
PWM_R2: U1.32(PA11) U3.12(Input 4)
R_ENCODER_A: U1.16(PA6) U5.3
R_ENCODER_B: U1.17(PA7) U5.4
RDX: H2.1 U1.43(PB7)
SWCLK: H1.3 R13.1 U1.37(PA14)
SWDIO: H1.2 R12.1 U1.34(PA13)
TDX: H2.2 U1.42(PB6)
$1N4190: R11.1 SW2.3 SW2.4
$1N9130: LED5.2(K) R29.1
$2N1329: C7.2 U2.10(REGOUT)
$2N1470: C8.1 U2.20(CPOUT)
$4N192: DC1.2 DC1.3 SW3.4
$4N2837: DC1.1 SW3.1
$4N3900: LED1.2(K) R20.1

Not connected (* = marked no-connect by the designer): H5 5* 6* 7* 8*; SW3 3* 6*; U1 2(PC13-TAMPER-RTC)* 3(PC14-OSC32_IN)* 4(PC15-OSC32_OUT)* 18(PB0)* 21(PB10)* 22(PB11)* 25(PB12)* 33(PA12)* 38(PA15)* 39(PB3)* 40(PB4)* 41(PB5)*; U2 2(NC)* 3(NC)* 4(NC)* 5(NC)* 6(AUX_DA)* 7(AUX_CL)* 12(INT)* 14(NC) 15(NC) 16(NC) 17(NC) 19(RESV) 21(RESV) 22(RESV)

## Notes on the sheets
sheet 1
- 电源滤波
- 主芯片
- BOOT
- 串口
- 晶振
- STLink
- 复位
sheet 2
- 电源滤波
- 芯片
- 备用
- 上拉
sheet 3
- L298N
- 电源滤波
- 反电动势过滤
- 输出
sheet 4
- 5V-LDO
- 电源输入
- 3V3-LDO

# Board PCB1
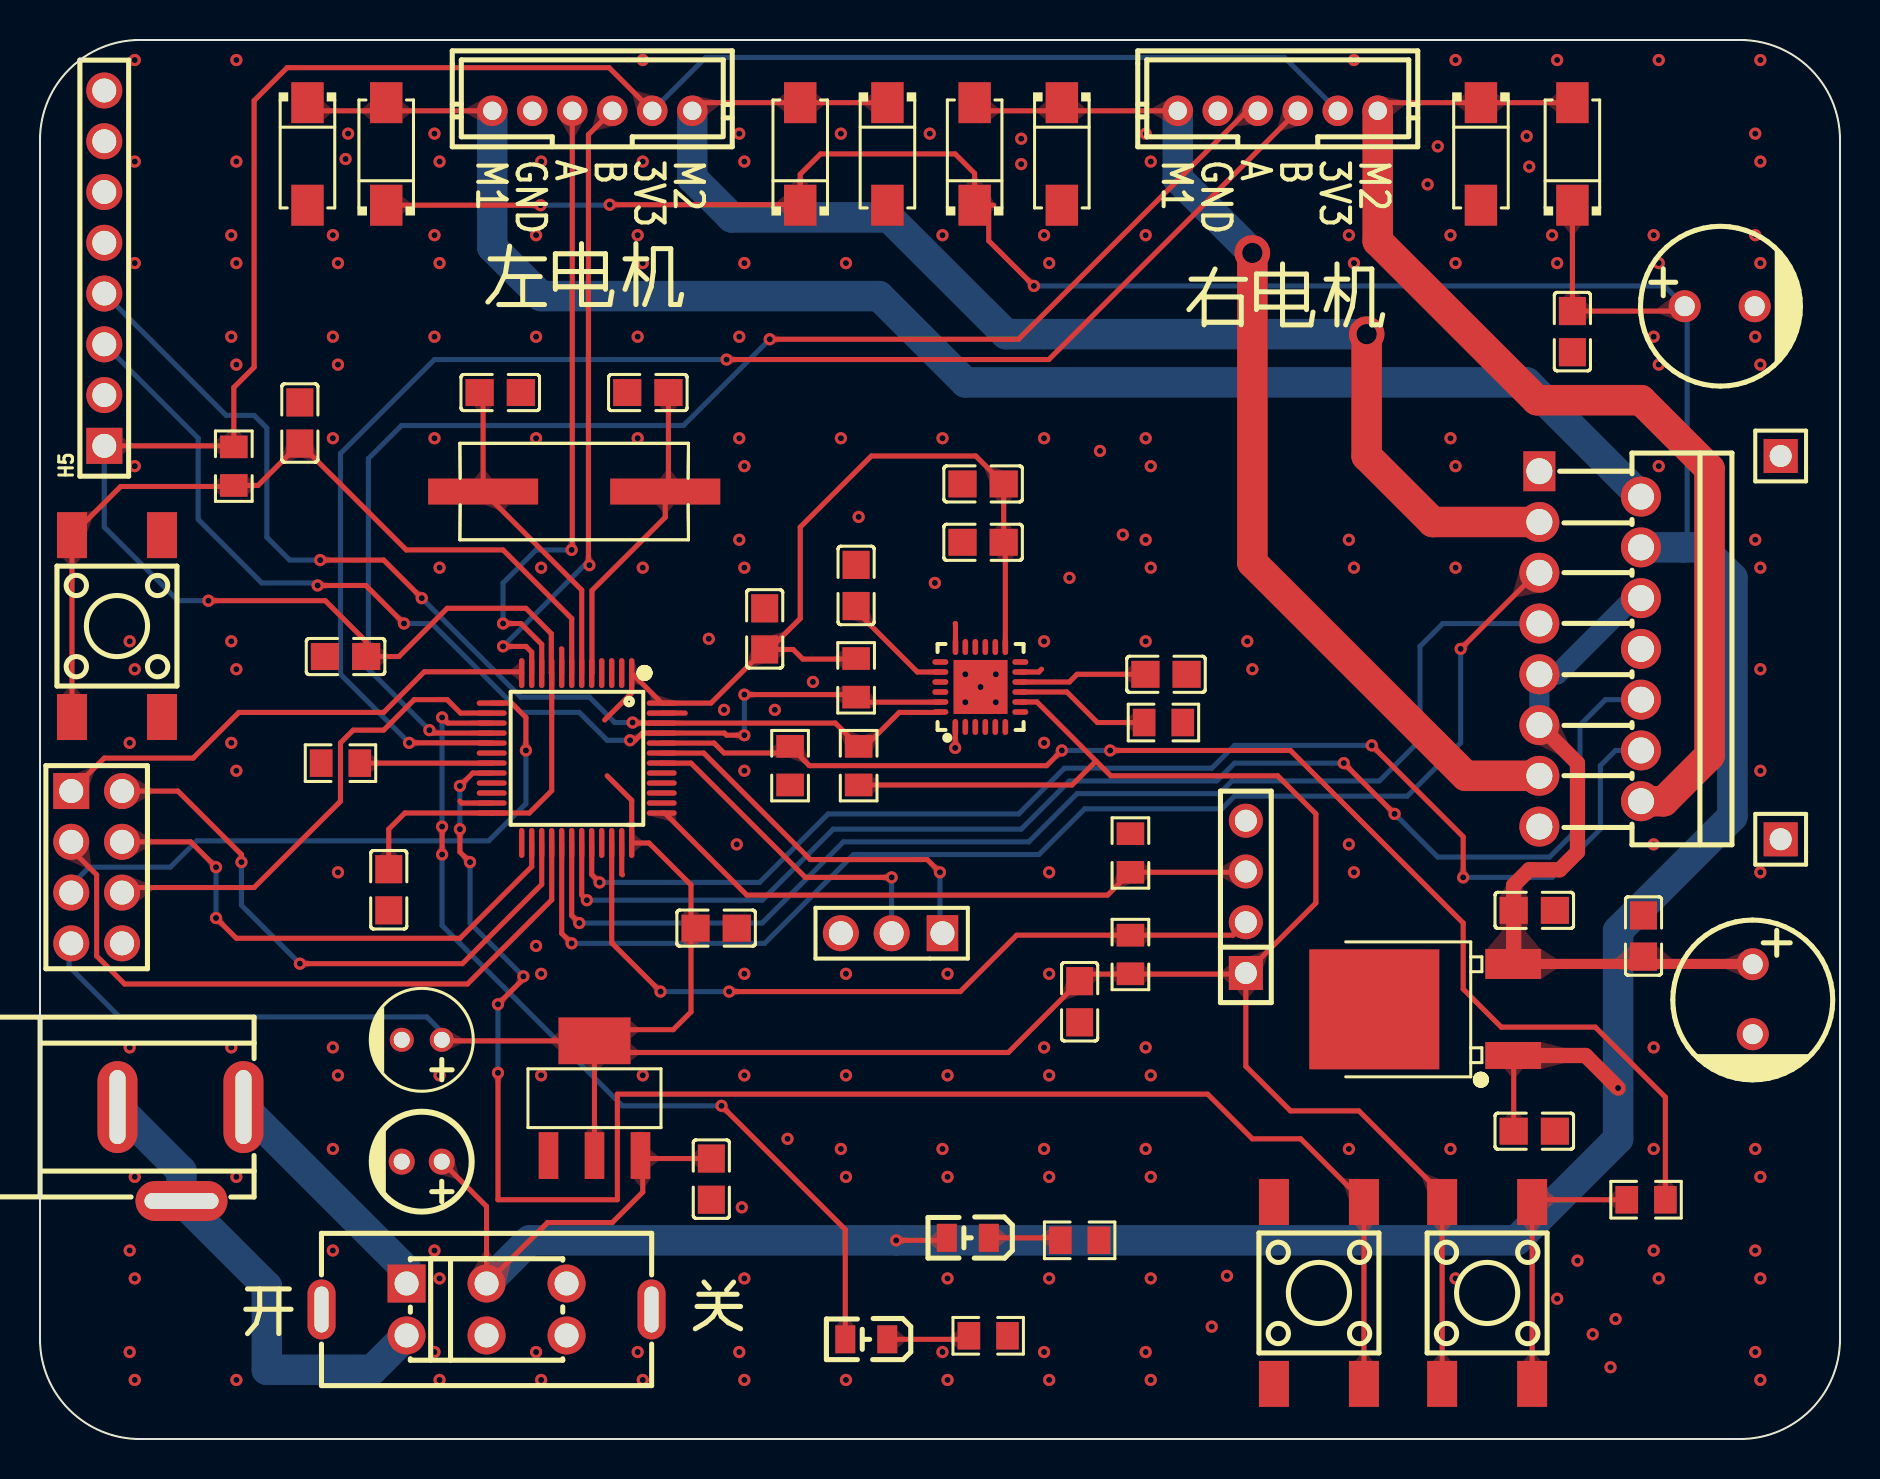
[diagram p5: board, top side]
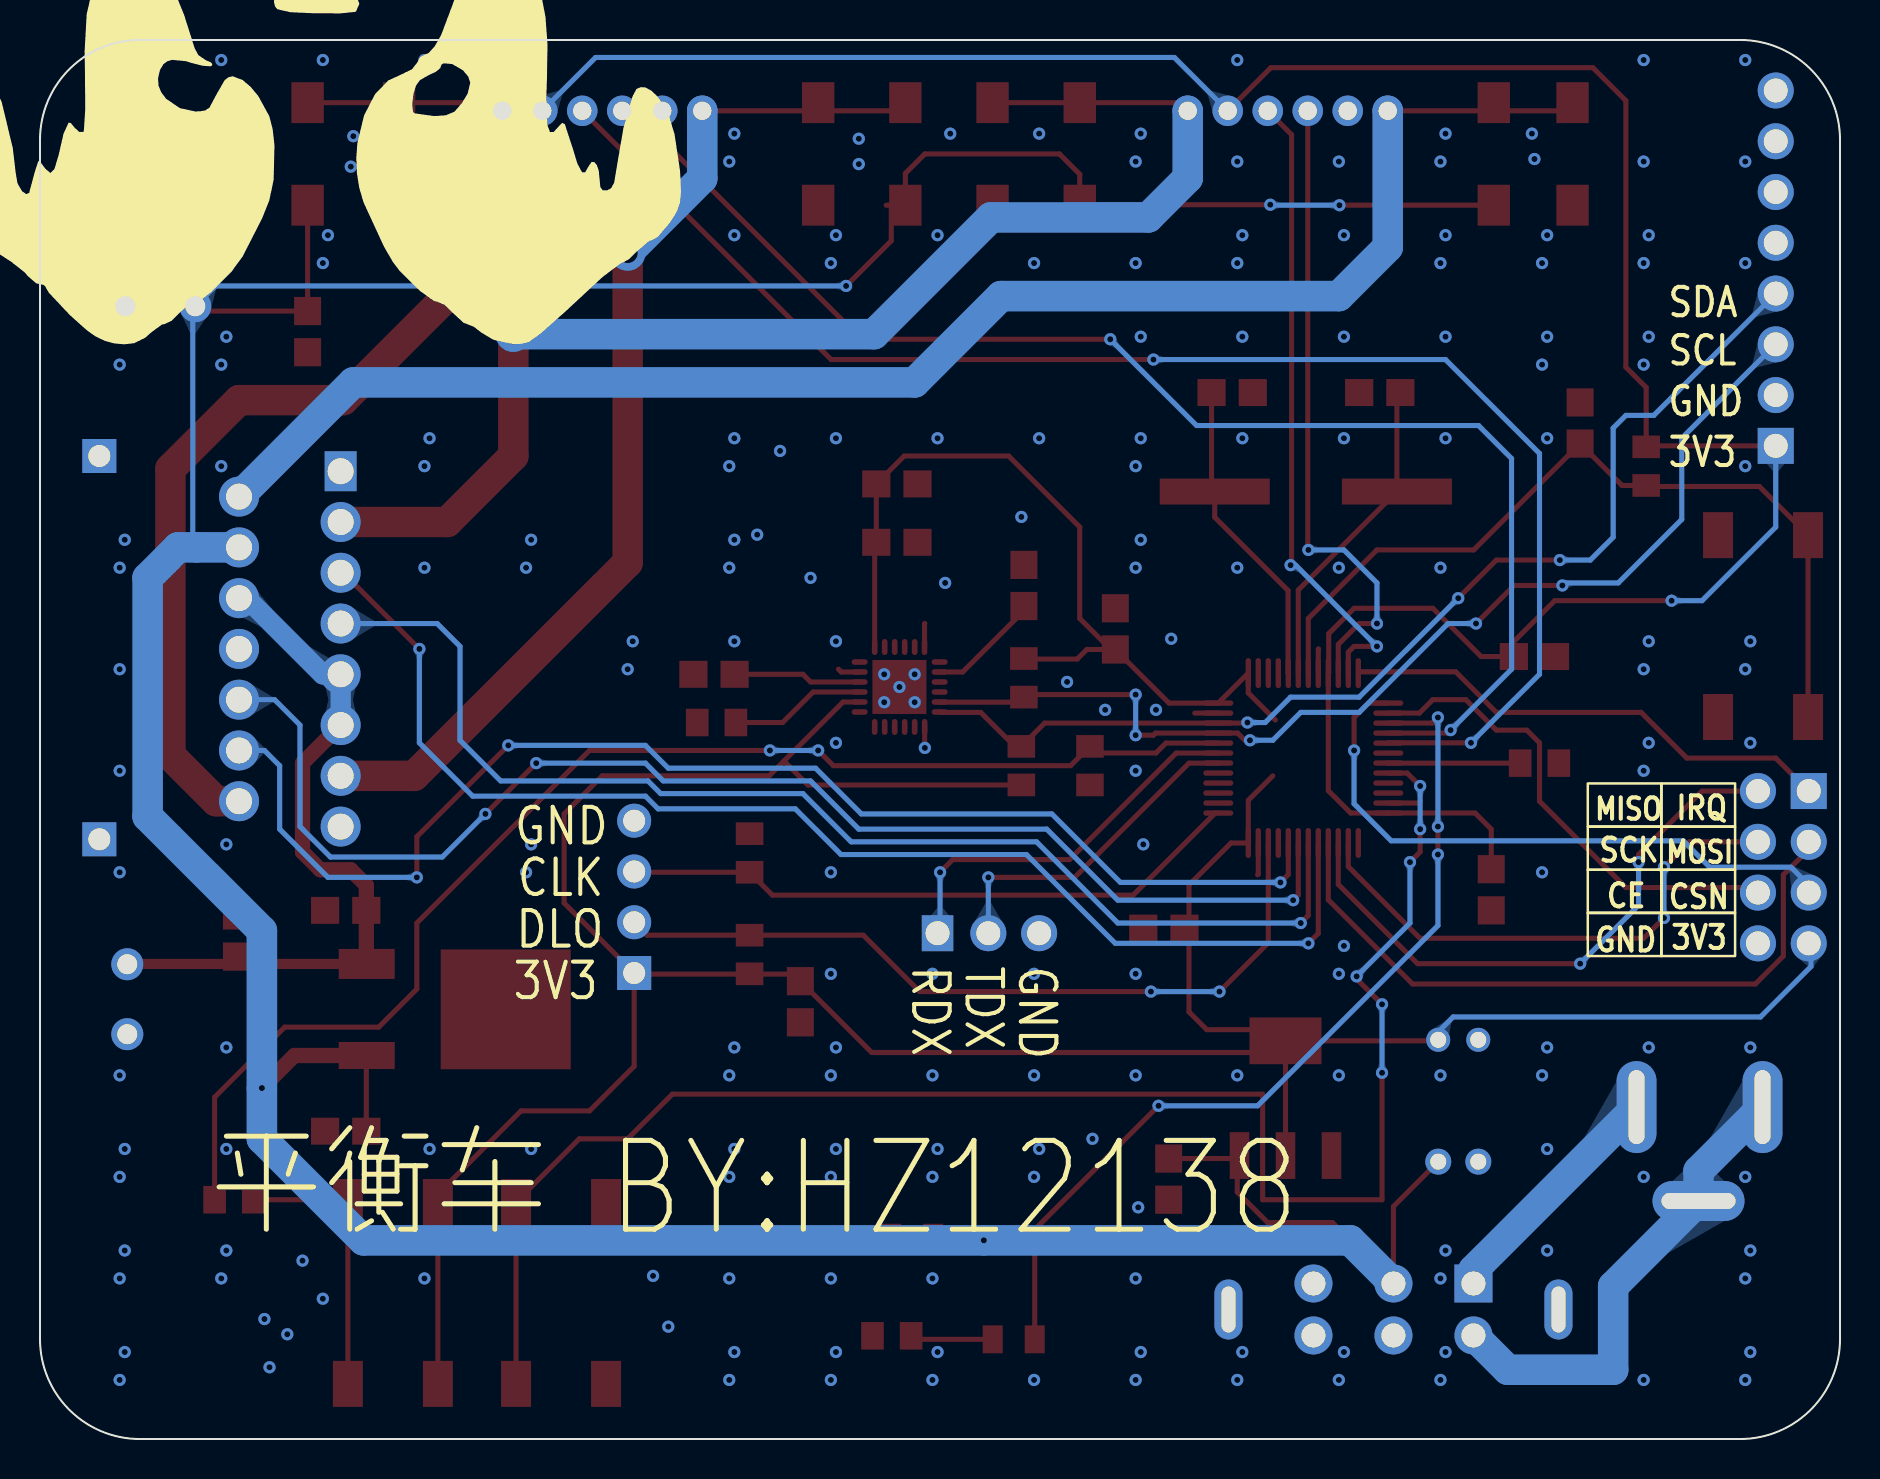
[diagram p6: board, bottom side, seen from below]

Outline 90 x 70 mm; copper layers: Top Layer, Bottom Layer. Coordinates in mm from the lower left corner of the outline.
Outline path: 41.74,70 45,70 ; 0,65 arc(1.46,68.54) 5,70 85,70 arc(88.54,68.54) 90,65 90,5 arc(88.54,1.46) 85,0 5,0 arc(1.46,1.46) 0,5 0,65
Stack: Top Layer 0.035mm / Dielectric1 1.51mm FR4 er 4.5 / Bottom Layer 0.035mm

## Design rules (mm)
spacing safeClearance (default): track to track 0.152, other pairs 0.152 to 0.3
track width trackWidth (default): min 0.127, default 0.254, max 2.54
differential pair differentialPair (default): width min 0.127, default 0.254, max 2.54; gap min 0.152, default 0.152
via viaSize (default): diameter min 0.5, default 0.61, max 10; hole min 0.3, default 0.305, max 6

## Placement (name value [footprint] x y rotation side)
C1  100nF  [C0805]  33.81 25.56 0 top
C2  100nF  [C0805]  17.44 27.48 270 top
C3  100nF  [C0805]  36.23 40.53 90 top
C4  100nF  [C0805]  15.28 39.15 180 top
C5  22pF  [C0805]  30.39 52.36 180 top
C6  22pF  [C0805]  23.01 52.36 0 top
C7  100nF  [C0805]  56.3 38.26 180 top
C8  2.2nF  [C0805]  40.81 42.71 90 top
C9  100nF  [C0805]  76.62 55.41 270 top
C10  100uF  [CAP-TH_BD8.0-P3.50-D0.6-FD]  85.64 22.01 270 top
C12  22uF  [CAP-TH_BD5.0-P2.00-D0.6-FD]  19.09 19.97 180 top
C13  100nF  [C0805]  33.57 13 270 top
C14  10uF  [CAP-TH_BD5.0-P2.00-D0.8-FD]  19.09 13.88 180 top
C15  100nF/50V  [C0805]  74.71 26.45 0 top
C16  330nF/50V  [C0805]  74.71 15.4 0 top
C19  100nF  [C0805]  12.99 50.84 90 top
C20  100nF  [C0805]  51.98 21.88 270 top
C21  10nF  [C0805]  47.16 47.79 180 top
C22  100nF  [C0805]  47.16 44.87 180 top
C23  100nF  [C0805]  80.18 25.17 90 top
C24  100uF  [CAP-TH_BD8.0-P3.50-D0.6-FD]  83.99 56.68 0 top
D1  1N4007  [SMA_L4.4-W2.8-LS5.4-RD]  17.31 64.3 90 top
D2  1N4007  [SMA_L4.4-W2.8-LS5.4-RD]  13.37 64.3 270 top
D3  1N4007  [SMA_L4.4-W2.8-LS5.4-RD]  38.01 64.3 90 top
D4  1N4007  [SMA_L4.4-W2.8-LS5.4-RD]  42.37 64.3 270 top
D5  1N4007  [SMA_L4.4-W2.8-LS5.4-RD]  46.73 64.3 90 top
D6  1N4007  [SMA_L4.4-W2.8-LS5.4-RD]  51.09 64.3 270 top
D7  1N4007  [SMA_L4.4-W2.8-LS5.4-RD]  76.62 64.3 90 top
D8  1N4007  [SMA_L4.4-W2.8-LS5.4-RD]  72.05 64.3 270 top
DC1  12V  [DC-IN-TH_DC005-T20]  7.02 14.26 0 top
H1  STLink  [HDR-TH_4P-P2.54-V-M]  60.29 27.13 90 top
H2  串口  [HDR-TH_3P-P2.54-V-M-1]  42.58 25.31 180 top
H5  A2541HWV-8P  [HDR-TH_8P-P2.54-V_A2541HWV-8P]  3.21 58.58 90 top
H6  A2541WV-2x4P  [HDR-TH_8P-P2.54-V-R2-C4-S2.54_A2541WV-2X4P]  2.83 28.61 270 top
LED1  电源  [LED0805-R-RD]  46.39 10.07 180 top
LED5  MPU6050  [LED0805-R-RD]  41.31 4.99 180 top
P1  2.54-1*1P针  [HDR-TH_1P-P2.54-V-M]  87.03 30.01 0 top
P2  2.54-1*1P针  [HDR-TH_1P-P2.54-V-M]  87.03 49.18 0 top
R2  4.7K  [R0805]  40.93 33.69 90 top
R3  4.7K  [R0805]  40.81 38.09 270 top
R4  10K  [R0805]  56.17 35.85 180 top
R8  10k  [R0805]  9.69 48.68 90 top
R9  10k  [R0805]  37.5 33.69 90 top
R10  10k  [R0805]  15.02 33.82 0 top
R11  100R  [R0805]  80.3 11.97 0 top
R12  10k  [R0805]  54.52 24.24 270 top
R13  10k  [R0805]  54.52 29.32 90 top
R20  4.7K  [R0805]  51.98 9.94 0 top
R29  1K  [R0805]  47.41 5.16 0 top
SW1  复位  [SW-SMD_4P-L6.0-W6.0-P4.50-LS9.0-2]  3.85 40.67 270 top
SW2  BOOT0  [SW-SMD_4P-L6.0-W6.0-P4.50-LS9.0-2]  72.36 7.31 90 top
SW3  -  [SW-TH_6P-L16.5-W7.5-P4.0-LS2.6-TL]  22.33 6.48 0 top
SW4  MPU6050  [SW-SMD_4P-L6.0-W6.0-P4.50-LS9.0-2]  63.95 7.31 90 top
U1  STM32F103C8T6  [LQFP-48_L7.0-W7.0-P0.50-LS9.0-BL]  26.84 34.07 180 top
U2  -  [QFN-24_L4.0-W4.0-P0.50-BL-EP2.7]  47.02 37.63 0 top
U3  -  [MULTIWATT-15_L19.6-W5.0-P1.27-L]  77.51 39.53 270 top
U4  -  [TO-252-2_L6.5-W6.1-P4.58-LS10.0-TL]  70.19 21.48 180 top
U5  -  [CONN-TH_6P_PH2.0D-L-6P]  61.89 66.46 0 top
U6  AMS1117-3V3  [SOT-223-3_L6.7-W3.7-P2.30-LS7.0-BR]  27.72 17.05 270 top
U8  -  [CONN-TH_6P_PH2.0D-L-6P]  27.61 66.46 0 top
X1  -  [HC-49S_L11.4-W4.8]  26.71 47.41 180 top

## Footprints (pads in the part's own frame, mm; a bottom-side part is the same pattern mirrored in y, then rotated)
C0805
  rect 1.41x1.35 smd: 1(-1.03,0) 2(1.03,0)
CAP-TH_BD5.0-P2.00-D0.6-FD
  round 1.202 hole 0.8: 1(-1.001,0) 2(1.001,0)
CAP-TH_BD5.0-P2.00-D0.8-FD
  round 1.3 hole 0.8: 1(-1.001,0) 2(1.001,0)
CAP-TH_BD8.0-P3.50-D0.6-FD
  round 1.6 hole 1: 1(-1.75,0) 2(1.75,0)
CONN-TH_6P_PH2.0D-L-6P
  round 1.524 hole 0.914: 1(-5,0) 2(-3,0) 3(-1,0) 4(1,0) 5(3,0) 6(5,0)
DC-IN-TH_DC005-T20
  oval 1.999x4.6 hole 0.8x3.701: 1(3.15,2.349) 2(-3.15,2.349)
  oval 4.6x1.999 hole 3.701x0.8: 3(0.051,-2.349)
HC-49S_L11.4-W4.8
  rect 5.5x1.3 smd: 1(-4.553,0) 2(4.553,0)
HDR-TH_1P-P2.54-V-M
  rect 1.7x1.7 hole 1.1: 1(0,0)
HDR-TH_3P-P2.54-V-M-1
  rect 1.575x1.801 hole 1.199: 1(-2.54,0)
  round 1.801 hole 1.199: 2(0,0) 3(2.54,0)
HDR-TH_4P-P2.54-V-M
  rect 1.7x1.7 hole 1.1: 1(-3.81,0)
  round 1.7 hole 1.1: 2(-1.27,0) 3(1.27,0) 4(3.81,0)
HDR-TH_8P-P2.54-V-R2-C4-S2.54_A2541WV-2X4P
  rect 1.8x1.8 hole 1.2: 1(-3.81,-1.27)
  round 1.8 hole 1.2: 2(-3.81,1.27) 3(-1.27,-1.27) 4(-1.27,1.27) 5(1.27,-1.27) 6(1.27,1.27) 7(3.81,-1.27) 8(3.81,1.27)
HDR-TH_8P-P2.54-V_A2541HWV-8P
  rect 1.801x1.801 hole 1.199: 1(-8.89,0)
  round 1.801 hole 1.199: 2(-6.35,0) 3(-3.81,0) 4(-1.27,0) 5(1.27,0) 6(3.81,0) 7(6.35,0) 8(8.89,0)
LED0805-R-RD
  rect 1x1.399 smd: 1(1.05,0) 2(-1.05,0)
LQFP-48_L7.0-W7.0-P0.50-LS9.0-BL
  oval 0.27x1.5 smd: 1(-2.75,-4.25) 2(-2.25,-4.25) 3(-1.75,-4.25) 4(-1.25,-4.25) 5(-0.75,-4.25) 6(-0.25,-4.25) 7(0.25,-4.25) 8(0.75,-4.25) 9(1.25,-4.25) 10(1.75,-4.25) 11(2.25,-4.25) 12(2.75,-4.25) 25(2.75,4.25) 26(2.25,4.25) 27(1.75,4.25) 28(1.25,4.25) 29(0.75,4.25) 30(0.25,4.25) 31(-0.25,4.25) 32(-0.75,4.25) 33(-1.25,4.25) 34(-1.75,4.25) 35(-2.25,4.25) 36(-2.75,4.25)
  oval 1.5x0.27 smd: 13(4.25,-2.75) 14(4.25,-2.25) 15(4.25,-1.75) 16(4.25,-1.25) 17(4.25,-0.75) 18(4.25,-0.25) 19(4.25,0.25) 20(4.25,0.75) 21(4.25,1.25) 22(4.25,1.75) 23(4.25,2.25) 24(4.25,2.75) 37(-4.25,2.75) 38(-4.25,2.25) 39(-4.25,1.75) 40(-4.25,1.25) 41(-4.25,0.75) 42(-4.25,0.25) 43(-4.25,-0.25) 44(-4.25,-0.75) 45(-4.25,-1.25) 46(-4.25,-1.75) 47(-4.25,-2.25) 48(-4.25,-2.75)
MULTIWATT-15_L19.6-W5.0-P1.27-L
  rect 1.999x1.6 hole 1.3: 1(-8.89,-2.54)
  round 1.999 hole 1.3: 2(-7.62,2.54) 3(-6.35,-2.54) 4(-5.08,2.54) 5(-3.81,-2.54) 6(-2.54,2.54) 7(-1.27,-2.54) 8(0,2.54) 9(1.27,-2.54) 10(2.54,2.54) 11(3.81,-2.54) 12(5.08,2.54) 13(6.35,-2.54) 14(7.62,2.54) 15(8.89,-2.54)
QFN-24_L4.0-W4.0-P0.50-BL-EP2.7
  oval 0.28x0.8 smd: 1(-1.25,-2) 2(-0.75,-2) 3(-0.25,-2) 4(0.25,-2) 5(0.75,-2) 6(1.25,-2) 13(1.25,2) 14(0.75,2) 15(0.25,2) 16(-0.25,2) 17(-0.75,2) 18(-1.242,2)
  oval 0.8x0.28 smd: 7(2,-1.25) 8(2,-0.75) 9(2,-0.25) 10(2,0.25) 11(2,0.75) 12(2,1.25) 19(-2,1.25) 20(-2,0.75) 21(-2,0.25) 22(-2,-0.25) 23(-2,-0.75) 24(-2,-1.25)
  rect 2.7x2.7 smd: 25(0.013,0)
R0805
  rect 1.133x1.377 smd: 1(-0.966,0) 2(0.966,0)
SMA_L4.4-W2.8-LS5.4-RD
  rect 2.046x1.62 smd: 1(-2.566,0) 2(2.566,0)
SOT-223-3_L6.7-W3.7-P2.30-LS7.0-BR
  rect 2.34x0.98 smd: 1(2.87,-2.3) 2(2.87,0) 3(2.87,2.3)
  rect 2.34x3.6 smd: 4(-2.87,0)
SW-SMD_4P-L6.0-W6.0-P4.50-LS9.0-2
  rect 2.3x1.5 smd: 1(-4.55,2.25) 2(4.55,2.25) 3(-4.55,-2.25) 4(4.55,-2.25)
SW-TH_6P-L16.5-W7.5-P4.0-LS2.6-TL
  rect 1.9x1.9 hole 1.2: 1(-4,1.3)
  round 1.9 hole 1.2: 2(0,1.3) 3(4,1.3) 4(-4,-1.3) 5(0,-1.3) 6(4,-1.3)
  oval 1.4x3 hole 0.7x2.3: 7(-8.25,0) 8(8.25,0)
TO-252-2_L6.5-W6.1-P4.58-LS10.0-TL
  rect 2.799x1.351 smd: 1(-3.474,2.291)
  rect 2.799x1.501 smd: 3(-3.474,-2.291)
  rect 6.5x6 smd: 4(3.474,-0.018)

## Nets
As in the schematic, except:
GND: C1.2 C2.2 C3.2 C4.2 C5.2 C6.2 C7.1 C8.2 C9.2 C10.2 C12.2 C13.2 C14.2 C15.2 C16.2 C19.2 C20.2 C21.2 C22.2 C23.2 C24.2 D2.2 D4.2 D6.2 D8.2 H1.4 H2.3 H5.2 H6.8 P1.1 P2.1 R4.1 R9.1 R10.1 R13.2 R20.2 R29.2 SW1.1 SW1.2 SW3.5 SW3.7 SW3.8 SW4.1 SW4.2 U1.8 U1.23 U1.35 U1.47 U2.1 U2.11 U2.18 U2.25 U3.1 U3.8 U3.15 U4.4 U5.2 U6.1 U8.2

Pads without a net: H5 5 6 7 8; SW3 3 6; U1 2 3 4 18 21 22 25 33 38 39 40 41; U2 2 3 4 5 6 7 14 15 16 17 19 21 22

## Via types
v1: diameter 0.61, hole 0.305, Top Layer to Bottom Layer, 265 vias
v2: diameter 1.778, hole 1.016, Top Layer to Bottom Layer, 2 vias

## Routing (per net, layer and track width the routed paths; a pad name or vN(x,y) marks a point on that pad's centre or on a via; arc(x,y) is an arc through that point)
3V3: length 329.7
  Top Layer w0.254: U6.4 28.28,20.48 31.66,20.48 32.55,21.37 32.55,27.72 30.45,29.82 U1.36 29.59,31.96 28.36,33.18 ; U6.4 20.14,19.92 C12.1 ; U6.4 28.31,19.34 48.41,19.34 C20.1 ; U6.4 U6.2 ; v1(8.42,41.95) 14.26,41.95 16.31,39.9 C4.1 17.95,39.15 20.36,41.56 24.3,41.56 25.57,40.29 25.57,38.34 U1.9 25.59,32.44 24.47,31.32 U1.24 18.24,31.32 17.44,30.52 17.44,28.51 ; 36.46,39.5 37.66,39.5 38.14,39.02 40.78,39.02 40.81,39.05 ; 36.46,39.5 38.01,41.06 38.01,45.63 41.57,49.18 46.79,49.18 C21.1 C22.1 48.27,44.79 U2.13 ; 36.46,39.5 C3.1 33.55,36.82 U1.48 U1.1 29.59,37.33 28.23,35.98 ; 51.73,23.26 60.24,23.26 H1.1 ; H1.1 63.79,26.82 63.79,31.28 61.89,33.18 53.54,33.18 52.8,33.92 ; H1.1 60.29,18.65 62.52,16.42 65.95,16.42 70.11,12.26 SW2.1 ; 52.8,33.92 51.6,32.72 R2.1 ; 52.8,33.92 49.85,36.88 U2.8 ; R8.2 9.69,52.61 10.71,53.63 10.71,66.96 12.36,68.62 28.45,68.62 U8.5 ; 9.36,49.47 9.36,49.69 H5.1
  Bottom Layer w0.254: v1(8.42,41.95) 6.9,41.95 3.21,45.63 H5.1 ; H6.7 1.45,24.69 1.45,23.64 3.98,21.12 19.34,21.12 20.09,20.37 C12.1 ; U5.5 62.22,69.12 33.28,69.12 U8.5
5V: length 36.1
  Top Layer w0.508: 73.66,23.77 85.62,23.77 C10.1
  Top Layer w0.762: U3.11 76.87,33.82 76.87,29.37 75.98,28.48 74.46,28.48 73.68,27.71 C15.1 73.68,23.79 73.66,23.77
  Bottom Layer w1.016: U3.6 79.67,42.07 75.86,38.26 U3.9 U3.11
GND: length 9
  Top Layer w0.254: U1.35 29.09,28.27 29.12,28.23 ; 50.08,38.52 49.94,38.38 U2.11 ; U1.23 21.08,31.82 20.99,31.91 ; U2.1 45.77,34.59 v1(45.76,34.58) ; U1.47 32.26,36.32 ; U1.8 26.09,39.52 26.07,39.53 ; 45.76,40.8 45.77,40.79 U2.18
  vias: v1(4.48,39.91) v1(4.48,34.83) v1(4.48,19.59) v1(4.48,9.43) v1(4.48,4.35) v1(4.74,69) v1(4.74,63.92) v1(4.74,58.84) v1(4.74,48.68) v1(4.74,38.52) v1(4.74,13.12) v1(4.74,8.04) v1(4.74,2.96) v1(9.56,60.23) v1(9.56,55.15) v1(9.56,39.91) v1(9.56,34.83) v1(9.56,19.59) v1(9.82,69) v1(9.82,63.92) v1(9.82,58.84) v1(9.82,53.76) v1(9.82,38.52) v1(9.82,33.44) v1(9.82,13.12) v1(9.82,2.96) v1(14.64,60.23) v1(14.64,55.15) v1(14.64,50.07) v1(14.64,19.59) v1(14.64,14.51) v1(14.64,9.43) v1(14.9,58.84) v1(14.9,53.76) v1(14.9,28.36) v1(14.9,18.2) v1(15.28,64.04) v1(15.41,65.31) v1(19.72,65.31) v1(19.72,60.23) v1(19.72,55.15) v1(19.72,50.07) v1(19.72,9.43) v1(19.72,4.35) v1(19.98,63.92) v1(19.98,58.84) v1(19.98,43.6) v1(19.98,18.2) v1(19.98,8.04) v1(19.98,2.96) v1(24.8,60.23) v1(24.8,55.15) v1(24.8,50.07) v1(24.8,24.67) v1(24.8,4.35) v1(25.06,63.92) v1(25.06,43.6) v1(25.06,23.28) v1(25.06,18.2) v1(25.06,2.96) v1(29.88,60.23) v1(29.88,55.15) v1(29.88,50.07) v1(29.88,4.35) v1(30.14,69) v1(30.14,63.92) v1(30.14,58.84) v1(30.14,43.6) v1(30.14,18.2) v1(30.14,2.96) v1(33.44,40.04) v1(34.2,36.48) v1(34.84,29.75) v1(34.96,65.31) v1(34.96,55.15) v1(34.96,50.07) v1(34.96,44.99) v1(34.96,4.35) v1(35.09,11.59) v1(35.22,63.92) v1(35.22,58.84) v1(35.22,48.68) v1(35.22,43.6) v1(35.22,33.44) v1(35.22,23.28) v1(35.22,18.2) v1(35.22,8.04) v1(35.22,2.96) v1(36.74,36.48) v1(37.38,15.02) v1(38.65,37.88) v1(40.04,65.31) v1(40.04,50.07) v1(40.04,14.51) v1(40.3,58.84) v1(40.3,23.28) v1(40.3,18.2) v1(40.3,13.12) v1(40.3,2.96) v1(40.93,46.14) v1(44.49,65.31) v1(44.74,42.83) v1(45.12,60.23) v1(45.12,50.07) v1(45.12,14.51) v1(45.12,4.35) v1(45.38,23.28) v1(45.38,18.2) v1(45.38,13.12) v1(45.38,8.04) v1(45.38,2.96) v1(46.27,38.26) v1(46.27,36.87) v1(47.03,37.63) v1(47.79,38.26) v1(47.79,36.87) v1(49.06,65.06) v1(49.06,63.79) v1(50.2,60.23) v1(50.2,50.07) v1(50.2,39.91) v1(50.2,34.83) v1(50.2,19.59) v1(50.2,14.51) v1(50.2,4.35) v1(50.46,58.84) v1(50.46,28.36) v1(50.46,23.28) v1(50.46,18.2) v1(50.46,13.12) v1(50.46,8.04) v1(50.46,2.96) v1(51.47,43.09) v1(53,49.44) v1(54.14,45.25) v1(55.28,65.31) v1(55.28,60.23) v1(55.28,50.07) v1(55.28,44.99) v1(55.28,39.91) v1(55.28,19.59) v1(55.28,14.51) v1(55.28,4.35) v1(55.54,63.92) v1(55.54,48.68) v1(55.54,43.6) v1(55.54,18.2) v1(55.54,13.12) v1(55.54,8.04) v1(55.54,2.96) v1(58.59,5.62) v1(59.35,8.16) v1(60.36,39.91) v1(60.62,38.52) v1(65.44,60.23) v1(65.44,44.99) v1(65.44,29.75) v1(65.44,14.51) v1(65.7,69) v1(65.7,58.84) v1(65.7,43.6) v1(65.7,28.36) v1(69.38,62.77) v1(69.89,64.68) v1(70.52,60.23) v1(70.52,50.07) v1(70.52,14.51) v1(70.78,69) v1(70.78,58.84) v1(70.78,48.68) v1(70.78,43.6) v1(70.78,8.04) v1(74.33,65.19) v1(74.46,63.66) v1(75.6,60.23) v1(75.86,69) v1(75.86,58.84) v1(75.86,7.02) v1(76.87,8.93) v1(77.64,5.24) v1(78.52,3.59) v1(78.78,6) v1(80.68,60.23) v1(80.68,55.15) v1(80.68,29.75) v1(80.68,19.59) v1(80.68,14.51) v1(80.68,9.43) v1(80.94,69) v1(80.94,58.84) v1(80.94,53.76) v1(80.94,48.68) v1(80.94,8.04) v1(85.76,65.31) v1(85.76,60.23) v1(85.76,55.15) v1(85.76,44.99) v1(85.76,14.51) v1(85.76,9.43) v1(85.76,4.35) v1(86.02,69) v1(86.02,63.92) v1(86.02,58.84) v1(86.02,53.76) v1(86.02,43.6) v1(86.02,38.52) v1(86.02,33.44) v1(86.02,28.36) v1(86.02,18.2) v1(86.02,13.12) v1(86.02,8.04) v1(86.02,2.96)
VCC: length 226.4
  Top Layer w0.254: v1(42.81,9.94) 45.22,9.94 LED1.1 ; 30.17,14.03 C13.1 ; 30.17,14.03 30.14,14 30.14,12.35 28.61,10.83 25.38,10.83 SW3.2 22.33,11.64 C14.1 ; 30.17,14.03 U6.3 ; U4.1 73.68,19.17 C16.1 ; 47.44,61.73 47.44,59.95 v1(49.7,57.69) ; 47.44,61.73 47.18,61.99 ; 47.44,61.73 47.69,61.73 ; 47.44,61.73 D5.1 46.73,63.32 45.76,64.3 39.03,64.3 38.01,63.28 D3.1 37.99,61.76 v1(28.49,61.76) ; D7.1 C9.1 81.61,56.44 82.36,57.19 ; 25.18,61.76 25.16,61.73 D1.1
  Top Layer w0.762: U4.1 77.28,19.19 v1(78.91,17.56)
  Bottom Layer w0.254: v1(49.7,57.69) 81.22,57.69 C24.1 ; 82.17,44.61 82.36,44.81 82.36,57.19 ; v1(28.49,61.76) 28.46,61.73 v1(25.03,61.73)
  Bottom Layer w1.524: SW3.2 24.49,9.94 v1(42.81,9.94) 73.83,9.94 78.91,15.02 v1(78.91,17.56) 78.91,25.44 84.62,31.15 84.62,43.09 83.1,44.61 U3.4
24L01_CE: length 25
  Top Layer w0.254: 3.45,27.61 3.47,27.59 10.71,27.59 15.02,31.91 15.02,34.83 15.66,35.47 17.18,35.47 18.71,36.99 20.36,36.99 21.03,36.32 U1.14
24L01_CSN: length 30.9
  Top Layer w0.254: U1.13 23.58,36.82 24.3,36.1 v1(24.3,34.45)
  Bottom Layer w0.254: 1.45,27.61 2.45,28.61 6.52,28.61 7.84,29.93 22.44,29.93 24.3,31.78 v1(24.3,34.45)
24L01_IRQ: length 25
  Top Layer w0.254: H6.1 3.21,34.07 7.66,34.07 9.94,36.36 17.18,36.36 19.22,38.39 24.02,38.39 U1.12
24L01_MISO: length 29.8
  Top Layer w0.254: v1(12.99,23.78) 21.12,23.78 25.09,27.75 U1.27 ; H6.2 6.9,32.42 10.07,29.25 v1(10.07,28.86)
  Bottom Layer w0.254: v1(10.07,28.86) 10.07,26.7 v1(12.99,23.78)
24L01_MOSI: length 33.9
  Top Layer w0.254: U1.28 25.59,26.98 21.37,22.77 4.23,22.77 2.83,24.17 2.83,28.23 1.45,29.61
24L01_SCK: length 26.6
  Top Layer w0.254: H6.4 7.53,29.88 v1(8.8,28.61) ; v1(8.8,26.07) 9.82,25.05 21,25.05 24.59,28.64 U1.26
  Bottom Layer w0.254: v1(8.8,28.61) v1(8.8,26.07)
BOOT0: length 65.5
  Top Layer w0.254: v1(51.09,34.45) 50.33,33.69 38.47,33.69 R9.2 37.17,34.33 34.2,34.33 33.71,34.82 U1.44 ; v1(53.51,34.45) 62.52,34.45 71.16,25.82 71.16,22.51 73.06,20.61 77.76,20.61 81.27,17.1 R11.2
  Bottom Layer w0.254: v1(51.09,34.45) v1(53.51,34.45)
BOOT1: length 6.6
  Top Layer w0.254: R10.2 22.58,33.82 U1.19
EN_KEY: length 84.3
  Top Layer w0.254: v1(24.17,23.15) 24.17,23.02 v1(22.9,21.75) ; v1(21.5,28.86) 20.99,29.37 v1(20.99,30.52) ; v1(20.99,32.67) 21.64,33.32 U1.20 ; SW4.3 SW4.4 63.03,15.02 60.62,15.02 58.38,17.26 28.87,17.26 28.87,11.97 22.9,11.97 v1(22.9,18.32)
  Bottom Layer w0.254: v1(22.9,21.75) v1(22.9,18.32) ; v1(20.99,30.52) v1(20.99,32.67) ; v1(24.17,23.15) 21.5,25.82 v1(21.5,28.86)
I2C_SCL: length 54.7
  Top Layer w0.254: v1(35.22,37.25) 40.68,37.25 41.06,36.87 45,36.87 U2.23 ; v1(35.22,35.21) 34.33,35.21 34.22,35.32 U1.45 30.12,35.32 29.76,34.96 v1(29.5,34.96) ; v1(18.2,40.8) 16.29,42.71 v1(13.88,42.71)
  Bottom Layer w0.254: v1(29.5,34.96) 28.36,34.96 26.96,36.36 24.04,36.36 19.6,40.8 v1(18.2,40.8) ; v1(35.22,37.25) v1(35.22,35.21) ; H5.3 7.91,50.07 7.91,46.01 11.09,42.83 13.88,42.83
I2C_SDA: length 55.1
  Top Layer w0.254: U2.24 45,36.36 42.96,36.36 41.26,34.66 R2.2 39.77,35.82 U1.46 29.66,35.82 v1(29.63,35.85) ; v1(19.09,42.07) 17.18,43.98 v1(14.01,43.98)
  Bottom Layer w0.254: v1(14.01,43.98) 12.48,43.98 11.34,45.12 11.34,50.58 10.71,51.22 9.31,51.22 H5.4 ; v1(29.63,35.85) 28.74,35.85 27.47,37.12 24.04,37.12 v1(19.09,42.07)
L_ENCODER_A: length 31.9
  Top Layer w0.254: v1(23.15,40.8) 24.04,40.8 25.09,39.76 U1.10 ; v1(26.58,44.48) 26.61,44.52 U8.3
  Bottom Layer w0.254: v1(26.58,44.48) 24.8,44.48 23.15,42.83 v1(23.15,40.8)
L_ENCODER_B: length 31.9
  Top Layer w0.254: v1(27.47,43.72) 27.42,43.77 27.42,65.26 U8.4 ; U1.11 24.59,39.37 24.3,39.66 v1(23.15,39.66)
  Bottom Layer w0.254: v1(23.15,39.66) 27.22,43.72 v1(27.47,43.72)
LED_EN: length 45
  Top Layer w0.254: v1(34.07,16.67) 40.26,10.48 LED5.1 ; U1.15 20.39,35.82 v1(20.1,36.1) ; v1(20.1,30.64) v1(20.1,29.25)
  Bottom Layer w0.254: v1(34.07,16.67) 29.12,16.67 20.1,25.69 v1(20.1,29.25) ; v1(20.1,30.64) v1(20.1,36.1)
M_L1: length 78.8
  Top Layer w0.254: D2.1 13.78,66.46 U8.1
  Bottom Layer w1.524: U3.2 74.33,52.87 46.27,52.87 41.95,57.19 25.06,57.19 22.61,59.63 U8.1
M_L2: length 66.3
  Top Layer w0.254: U8.6 33.02,66.86 D3.2 D4.1
  Top Layer w1.524: v2(66.33,55.28) 66.33,49.18 69.63,45.88 U3.3
  Bottom Layer w1.524: v2(66.33,55.28) 48.3,55.28 42.46,61.12 34.58,61.12 32.61,63.09 U8.6
M_R1: length 53.2
  Top Layer w0.254: D5.2 47.14,66.46 U5.1
  Top Layer w1.524: U3.13 71.29,33.18 60.62,43.85 v2(60.62,59.34)
  Bottom Layer w1.524: U5.1 56.89,63.07 v2(60.62,59.34)
M_R2: length 56.5
  Top Layer w0.254: U5.6 67.29,66.86 D8.1 D7.2
  Top Layer w1.524: U5.6 66.89,59.93 74.84,51.98 80.05,51.98 83.48,48.55 83.48,34.2 81.19,31.91 U3.14
MPU6050_AD0: length 6.8
  Top Layer w0.254: R4.2 52.87,35.85 51.34,37.38 U2.9
NRST: length 42.3
  Top Layer w0.254: SW1.4 1.6,45.23 4.03,47.66 9.64,47.66 R8.1 10.9,47.71 C19.1 18.31,44.48 23.15,44.48 26.59,41.05 U1.7
OSC_IN: length 15.6
  Top Layer w0.254: U1.5 27.6,38.33 27.6,42.45 31.26,46.12 X1.1 31.42,47.57 C5.1
OSC_OUT: length 16.2
  Top Layer w0.254: U1.6 27.09,42.48 X1.2 22.16,52.19 C6.1
PWM_L1: length 64
  Top Layer w0.254: U1.29 26.09,25.3 v1(26.58,24.8) ; v1(71.03,39.53) 74.84,43.34 U3.5
  Bottom Layer w0.254: v1(26.58,24.8) 36.23,24.8 40.68,29.25 49.95,29.25 52.24,31.53 59.09,31.53 59.73,32.17 68.36,32.17 71.03,34.83 v1(71.03,39.53)
PWM_L2: length 61.1
  Top Layer w0.254: v1(26.96,25.82) 26.59,26.19 U1.30
  Bottom Layer w0.254: U3.7 70.14,40.8 69,39.66 69,34.96 66.97,32.93 59.6,32.93 58.97,32.29 51.85,32.29 49.44,29.88 40.17,29.88 36.11,25.82 v1(26.96,25.82)
PWM_R1: length 66.7
  Top Layer w0.254: v1(65.19,33.82) v1(67.73,31.28) ; U1.31 27.09,27.22 v1(27.34,26.96)
  Bottom Layer w0.254: v1(67.73,31.28) 69.89,29.12 75.48,29.12 77,30.64 77,35.72 78.27,36.99 U3.10 ; v1(27.34,26.96) 36.11,26.96 39.66,30.52 49.06,30.52 51.47,32.93 58.84,32.93 59.73,33.82 v1(65.19,33.82)
PWM_R2: length 65.5
  Top Layer w0.254: v1(27.98,27.85) 27.59,28.24 U1.32 ; v1(66.59,34.71) 71.16,30.13 v1(71.16,28.1)
  Bottom Layer w0.254: v1(66.59,34.71) 59.73,34.71 58.59,33.56 51.22,33.56 48.93,31.28 39.41,31.28 35.98,27.85 v1(27.98,27.85) ; v1(71.16,28.1) 75.6,28.1 78.02,30.52 78.02,33.69 78.78,34.45 U3.12
R_ENCODER_A: length 69.7
  Top Layer w0.254: v1(19.47,35.47) 19.62,35.32 U1.16 ; v1(36.49,55.03) 48.93,55.03 60.36,66.46 U5.3
  Bottom Layer w0.254: v1(36.49,55.03) 32.17,50.71 18.07,50.71 16.42,49.06 16.42,38.52 v1(19.47,35.47)
R_ENCODER_B: length 75
  Top Layer w0.254: v1(34.33,54.01) 50.44,54.01 U5.4 ; U1.17 22.57,34.83 v1(18.45,34.83)
  Bottom Layer w0.254: v1(34.33,54.01) 19.72,54.01 15.02,49.31 15.02,38.26 v1(18.45,34.83)
RDX: length 19.5
  Top Layer w0.254: v1(45,28.36) 44.36,28.99 38.52,28.99 33.19,34.32 U1.43
  Bottom Layer w0.254: H2.1 45,25.44 v1(45,28.36)
SWCLK: length 31.4
  Top Layer w0.254: H1.3 60.25,28.36 R13.1 53.38,27.21 35.34,27.21 31.24,31.32 U1.37
SWDIO: length 39.1
  Top Layer w0.254: U1.34 28.59,24.83 v1(31.03,22.39) ; v1(34.46,22.39) 46.01,22.39 48.83,25.21 R12.1 59.64,25.21 H1.2
  Bottom Layer w0.254: v1(31.03,22.39) v1(34.46,22.39)
TDX: length 16.7
  Top Layer w0.254: v1(42.58,28.1) 38.27,28.1 32.55,33.82 31.09,33.82 U1.42
  Bottom Layer w0.254: v1(42.58,28.1) H2.2
$1N4190: length 13.9
  Top Layer w0.254: SW2.3 SW2.4 74.72,11.97 R11.1
$1N9130: length 4.2
  Top Layer w0.254: R29.1 46.27,4.99 LED5.2
$2N1329: length 6.4
  Top Layer w0.254: C7.2 51.85,38.26 51.47,37.88 U2.10
$2N1470: length 5.7
  Top Layer w0.254: U2.20 43.87,38.38 40.81,41.44 C8.1
$4N192: length 23.9
  Bottom Layer w1.524: DC1.2 7.07,13.41 DC1.3 11.34,7.64 11.34,3.46 16.61,3.46 SW3.4
$4N2837: length 12.2
  Bottom Layer w1.524: DC1.1 18.33,8.45 SW3.1
$4N3900: length 3.6
  Top Layer w0.254: R20.1 50.89,10.07 LED1.2

## Copper pours and planes (outline as drawn; the poured copper is in the pictures)
3V3 on Top Layer: 24.8,36.61 29.12,36.61 29.12,32.42 24.8,32.42
GND on Top Layer: -15.2,78.39 104.31,78.39 104.31,-11.14 -15.2,-11.14
GND on Bottom Layer: -13.55,77.12 100.11,77.12 100.11,-12.28 -13.55,-12.28

Small or netless copper shapes (teardrops, artwork), in the pictures only: 230 on Top Layer, 73 on Bottom Layer

## Text on the board
Bottom Silkscreen Layer: MOSI | MISO | IRQ | 3V3 | CSN | CE | SCK | GND | SDA | SCL | TDX | RDX | CLK | DLO | 平衡车 BY:HZ12138
Top Silkscreen Layer: M1 | GND | A | B | 3V3 | M2 | 开 | 关 | 左电机 | 右电机
